# Altium project MCXE31B.PrjPcb (part 1 of 2)
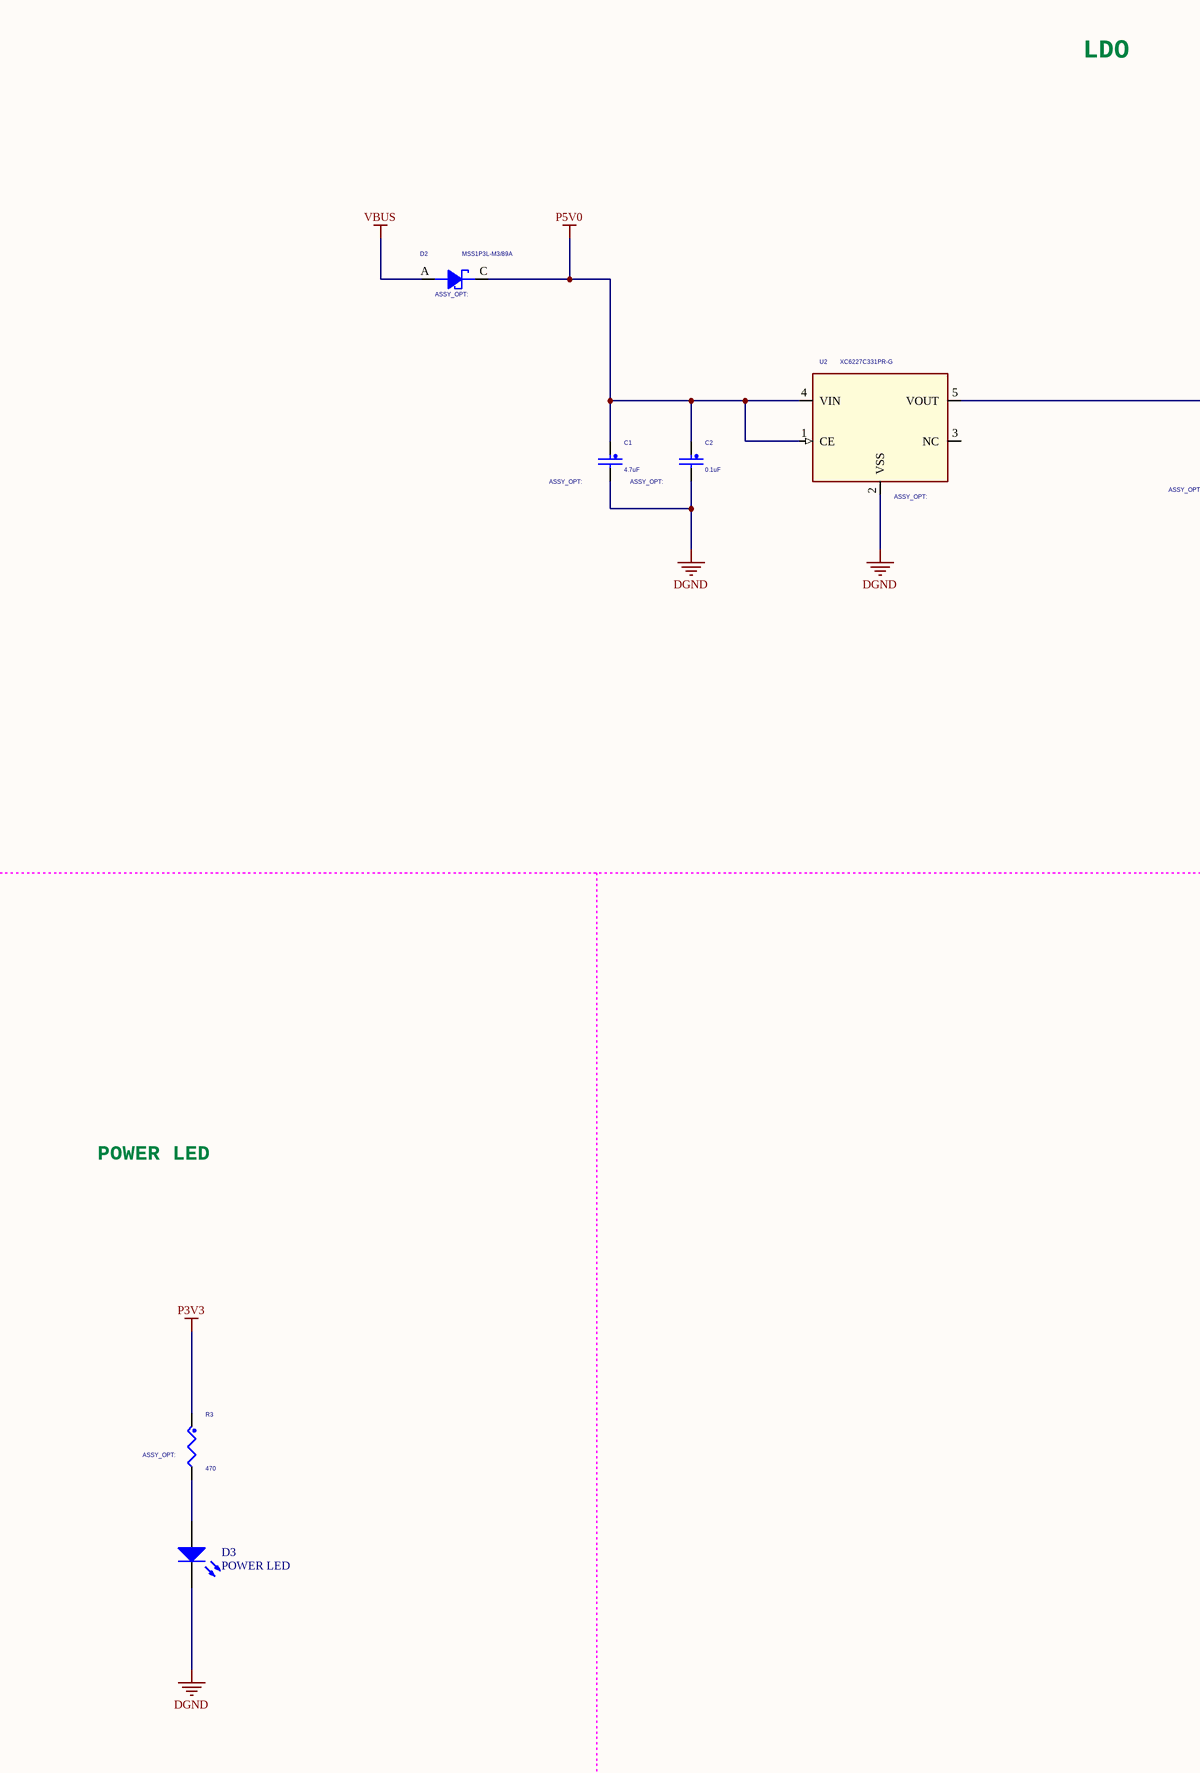
[diagram p0: 03 POWER.SchDoc, left]
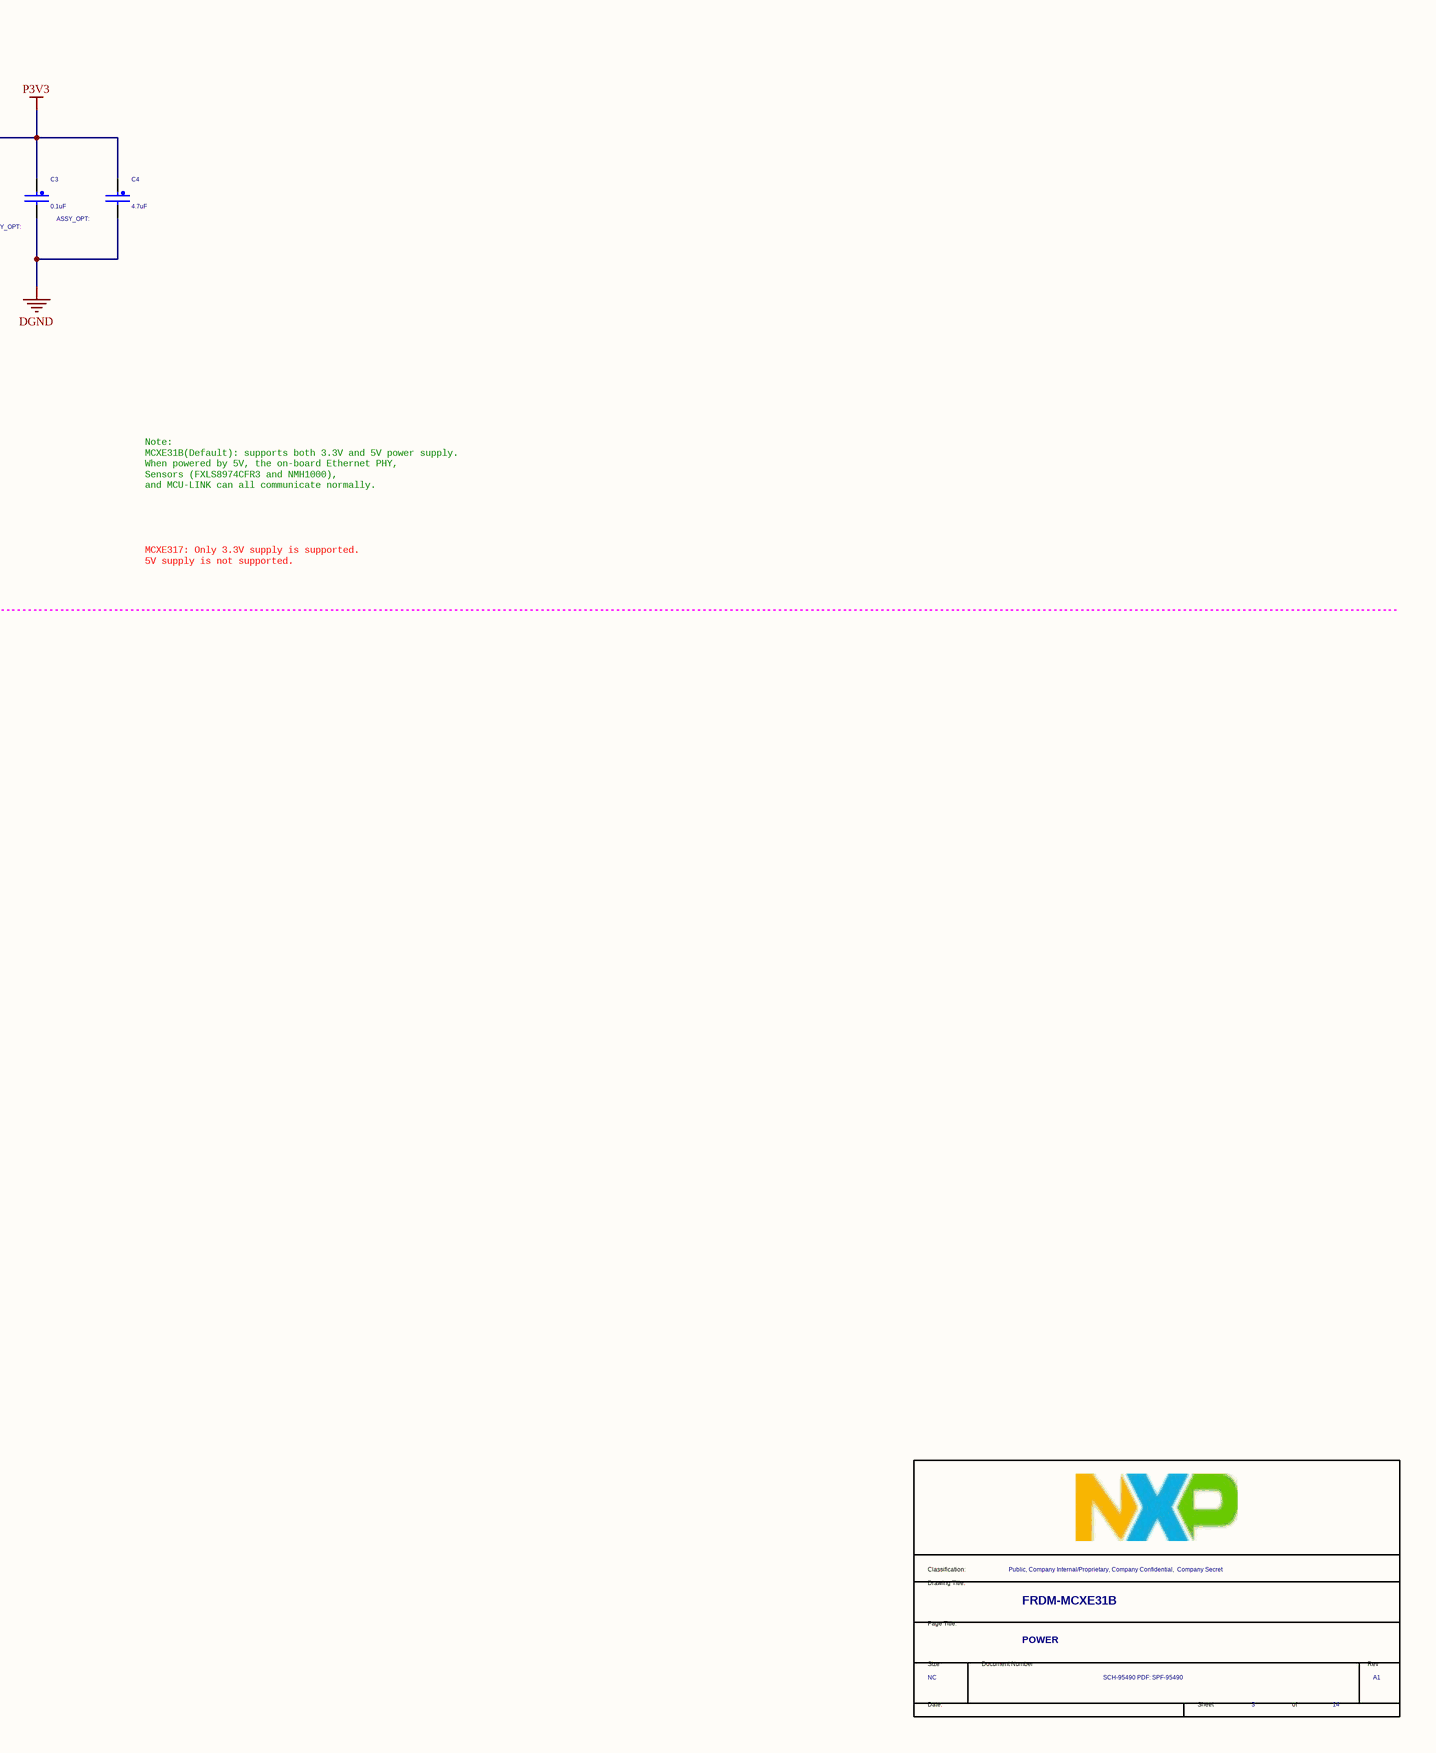
[diagram p1: 03 POWER.SchDoc, right]
13 sheets, 228 parts. Net scope: global (net labels, ports and power ports of the same name join across sheets).
Board file: MCXE31B.PcbDoc
Sheets:
  03 POWER.SchDoc
  04 MCU_AB.SchDoc
  05 MCU_C.SchDoc
  06 MCU_PORT.SchDoc
  07 MCU_LINK.SchDoc
  08 MCU_LINK_DEBUG.SchDoc
  09 ETHERNET_ENET.SchDoc
  10 CAN.SchDoc
  12 SWITCH & LED.SchDoc
  13 HEADERS.SchDoc
  CAN1.SchDoc
  UART.SchDoc
  UART2.SchDoc

## Sheet 03 POWER.SchDoc
size 513 x 386 mm

### Parts
(Parts that share a designator on the sheet are numbered #1, #2 ... from top to bottom, then left to right.)
*#1  Title: FRDM-MCXE31B  RevCode: A1  PageTitle: POWER  Page Size: NC  Page Number: 3  Page Count: 14  Doc: SCH-95490 PDF: SPF-95490  Classification: Public, Company Internal/Proprietary, Company Confidential,  Company Secret  (hidden comment: TitleBlock_FS)  (graphical)
C1  4.7uF  [CC0603_OV]
C2  0.1uF  [CC0402_25]
C3  0.1uF  [CC0402_25]
C4  4.7uF  [CC0603_OV]
D2  MFG_PN01: MSS1P3L-M3/89A  [smb_2p7x1p4]  (hidden comment: MSS1P3L)
D3  POWER LED  [LED 0603R]
R3  470  [RC0402_25]
U2  XC6227C331PR-G  [XC6227C331PR-G]

### Nets
DGND: C1.2 C2.2 C3.2 C4.2 D3.2(K) U2.2(VSS)
P3V3: C3.1 C4.1 R3.1 U2.5(VOUT)
P5V0: C1.1 C2.1 D2.C U2.1(CE) U2.4(VIN)
VBUS: D2.A
NetD3_1: D3.1(A) R3.2

Not connected (* = marked no-connect by the designer): U2 3(NC)

### Notes on the sheet
- LDO
- Note:
  MCXE31B(Default): supports both 3.3V and 5V power supply.
  When powered by 5V, the on-board Ethernet PHY,
  Sensors (FXLS8974CFR3 and NMH1000),
  and MCU-LINK can all communicate normally.
- MCXE317: Only 3.3V supply is supported.
  5V supply is not supported.
- POWER LED
- (in symbol TitleBlock_FS) Classification:; Drawing Title:; Page Title:; Size; Document Number; Rev; Date:; Sheet; of

### Library data of the parts
*#1 = TitleBlock_FS: OrgAddr2: Austin, TX 78735-8598; OrgAddr1: 6501 William Cannon Drive West; OrgName: NXP Semiconductors; Page Create Date: March  8, 1995
C1 C4 = CAP_NP: CAP CER 4.7uF 10V 20% X5R 0603; CLASS: DISCRETE; Temp Range: -55C TO 85C; TOL: 10%; FPLIST: CC0603_OV,CC0603,0603_CC; CAD_APPROVED: Yes; MFG_PN01: 885012106012; MFG_NAME01: WURTH ELEKTRONIK; AGILE_PN: 150-81893; ROOM: CPU; SIGNAL_MODEL: DEFAULT_CAPACITOR_220000pF_2_1; 3D_Mechanical_Footprint_File: http://fcl.am.freescale.net/ALLEGRO/step/cc0603_ov.STEP; Rated Voltage: 10V; Package Type: WCAP-CSGP_0603; Package Size: 0603; VOLTAGE: 10V; WVDC: 10V; HEIGHT: 0.87; ROHS: Yes; Tolerance: 20%
C2 = CAP_NP: CAP CER 0.1UF 16V 10% X7R 0402; CLASS: DISCRETE; MFG_PN01: CL05B104KO5NNNC; MFG_NAME01: Samsung Electro-Mechanics; Temp Range: -55C to +125C; CAD_APPROVED: Yes; FPLIST: CC0402_25,CC0402_HD,0402_CC,CAPC0402_L,cc0402_lamp3; AGILE_PN: 150-75182; 3D_Mechanical_Footprint_File: http://fcl.am.freescale.net/ALLEGRO/step/cc0402_25.STEP; ROHS: NULL; Rated Voltage: 16V; Tolerance: 10%; HEIGHT: 0.635mm
C3 = CAP_NP: CAP CER 0.1UF 16V 10% X7R 0402; CLASS: DISCRETE; Temp_Range: -55癈 to +85癈; FPLIST: CC0402_25,CC0402_HD,0402_CC,CAPC0402_L,cc0402_lamp3; CAD_APPROVED: Yes; MFG_PN01: CL05B104KO5NNNC; MFG_NAME01: Samsung Electro-Mechanics; AGILE_PN: 150-75182; SIGNAL_MODEL: DEFAULT_CAPACITOR_100000pF_2_1; Temp Range: -55C to +125C; VOLTAGE: 16V; TOL: 10%; HEIGHT: 0.635mm; ROHS: NULL; Tolerance: 10%; Rated Voltage: 16V; 3D_Mechanical_Footprint_File: http://fcl.am.freescale.net/ALLEGRO/step/cc0402_25.STEP
D2 = DIODE_SCHTKY: DIODE SCH 1A 30V MICROSMP SMT; CLASS: IC; MFG_NAME01: VISHAY INTERTECHNOLOGY; CAD_APPROVED: Yes; AGILE_PN: 480-76978; 3D_Mechanical_Footprint_File: http://fcl.am.freescale.net/ALLEGRO/step/smb_2p7x1p4.step; Rated Voltage: 30V; HEIGHT: 0.73
D3 = LED-SMT
R3 = RES: RES MF 470 OHM 1/16W 5% 0402; CLASS: DISCRETE; MFG_PN01: ERJ2GEJ471X; MFG_NAME01: PANASONIC; CAD_APPROVED: Yes; AGILE_PN: 470-30315; FPLIST: RC0402_25,RC0402_HD,0402_CC; ROHS: Yes; Tolerance: 5%; HEIGHT: 0.45
U2 = XC6227C_5P: IC VREG LDO  3.3V 0.7A 1.7-6.0V SOT-89-5; MFG_NAME01: TOREX; Temp Range: -40°C to 85°C; VOLTAGE: 1.7V ~ 6.0V; CAD_APPROVED: Yes; AGILE_PN: 315-80827; CLASS: IC; 3D_Mechanical_Footprint_File: http://fcl.am.freescale.net/ALLEGRO/step/sot89-5.STEP; MFG_PN01: XC6227C331PR-G; ROHS: NULL; HEIGHT: 1.6mm

## Sheet 04 MCU_AB.SchDoc
size 513 x 386 mm
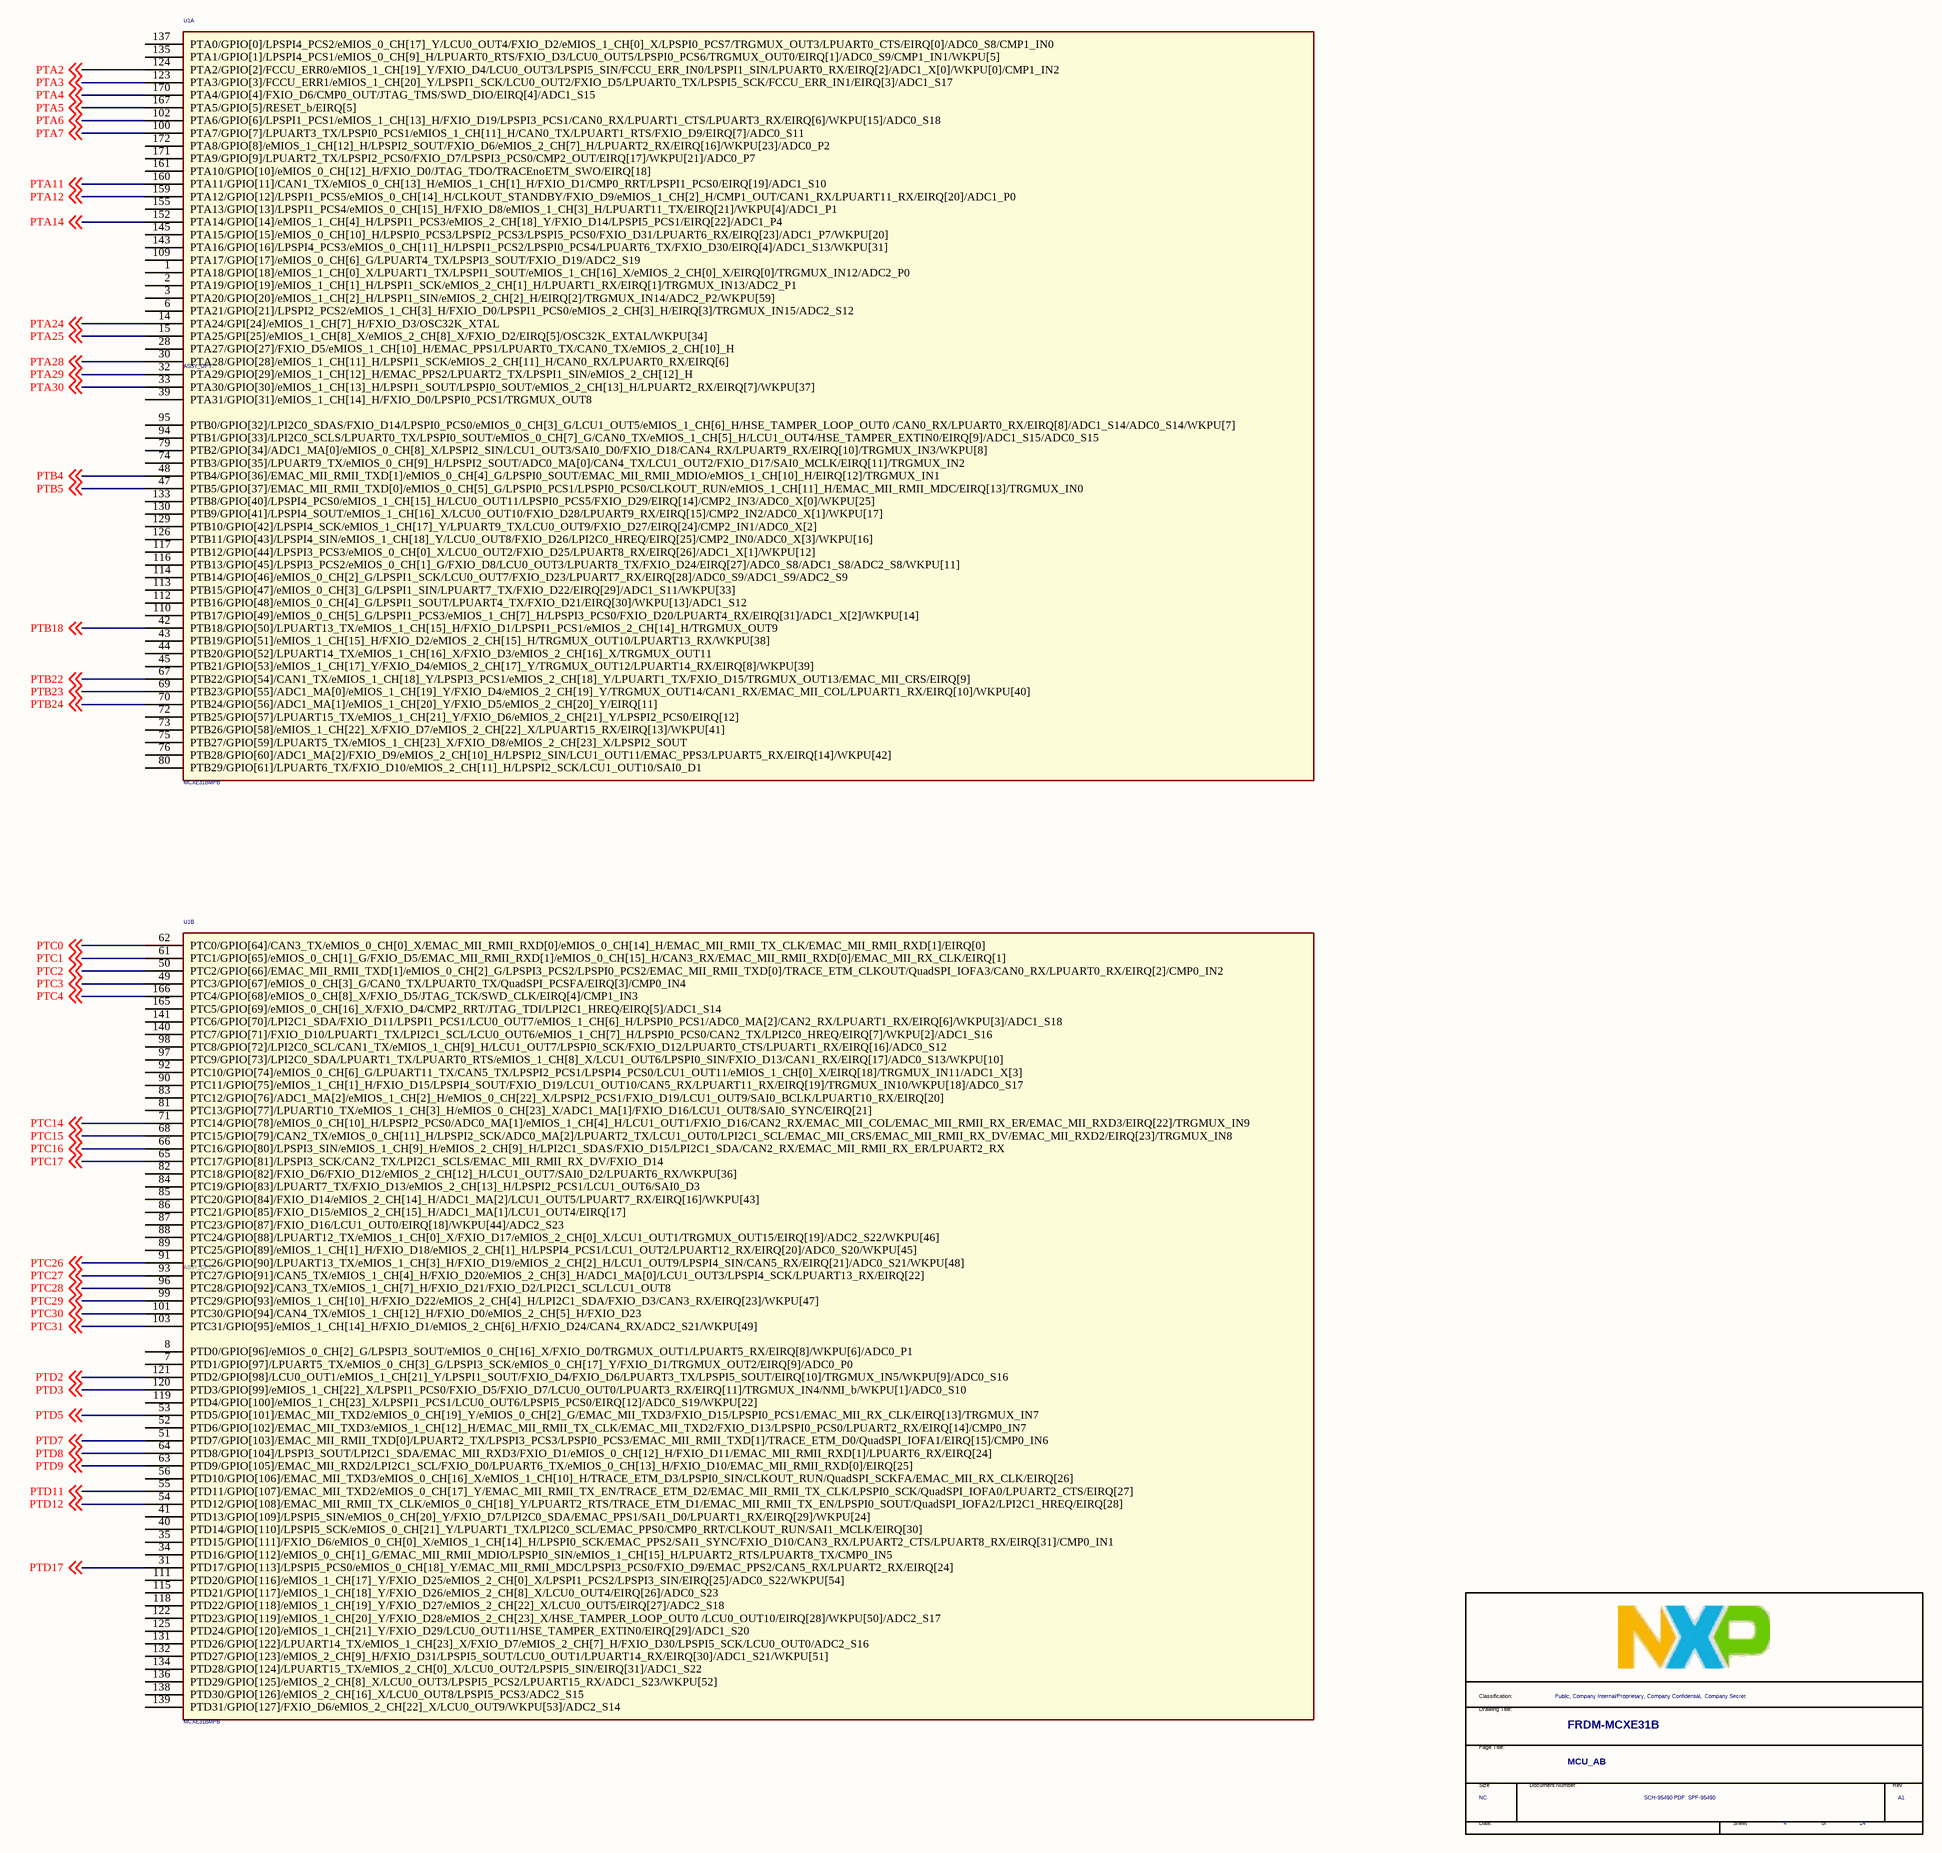
[diagram p2: 04 MCU_AB.SchDoc]

### Parts
(Parts that share a designator on the sheet are numbered #1, #2 ... from top to bottom, then left to right.)
*#2  Title: FRDM-MCXE31B  RevCode: A1  PageTitle: MCU_AB  Page Size: NC  Page Number: 4  Page Count: 14  Doc: SCH-95490 PDF: SPF-95490  Classification: Public, Company Internal/Proprietary, Company Confidential,  Company Secret  (hidden comment: TitleBlock_FS)  (graphical)
U1  MCXE31BMPB  [QFP-172_L16.0-W16.0-P0.65-LS19.0-TL]  (parts A,B of 4)

### Nets
PTA2: U1.124(PTA2/GPIO[2]/FCCU_ERR0/eMIOS_1_CH[19]_Y/FXIO_D4/LCU0_OUT3/LPSPI5_SIN/FCCU_ERR_IN0/LPSPI1_SIN/LPUART0_RX/EIRQ[2]/ADC1_X[0]/WKPU[0]/CMP1_IN2) ; off-sheet PTA2
PTA3: U1.123(PTA3/GPIO[3]/FCCU_ERR1/eMIOS_1_CH[20]_Y/LPSPI1_SCK/LCU0_OUT2/FXIO_D5/LPUART0_TX/LPSPI5_SCK/FCCU_ERR_IN1/EIRQ[3]/ADC1_S17) ; off-sheet PTA3
PTA4: U1.170(PTA4/GPIO[4]/FXIO_D6/CMP0_OUT/JTAG_TMS/SWD_DIO/EIRQ[4]/ADC1_S15) ; off-sheet PTA4
PTA5: U1.167(PTA5/GPIO[5]/RESET_b/EIRQ[5]) ; off-sheet PTA5
PTA6: U1.102(PTA6/GPIO[6]/LPSPI1_PCS1/eMIOS_1_CH[13]_H/FXIO_D19/LPSPI3_PCS1/CAN0_RX/LPUART1_CTS/LPUART3_RX/EIRQ[6]/WKPU[15]/ADC0_S18) ; off-sheet PTA6
PTA7: U1.100(PTA7/GPIO[7]/LPUART3_TX/LPSPI0_PCS1/eMIOS_1_CH[11]_H/CAN0_TX/LPUART1_RTS/FXIO_D9/EIRQ[7]/ADC0_S11) ; off-sheet PTA7
PTA11: U1.160(PTA11/GPIO[11]/CAN1_TX/eMIOS_0_CH[13]_H/eMIOS_1_CH[1]_H/FXIO_D1/CMP0_RRT/LPSPI1_PCS0/EIRQ[19]/ADC1_S10) ; off-sheet PTA11
PTA12: U1.159(PTA12/GPIO[12]/LPSPI1_PCS5/eMIOS_0_CH[14]_H/CLKOUT_STANDBY/FXIO_D9/eMIOS_1_CH[2]_H/CMP1_OUT/CAN1_RX/LPUART11_RX/EIRQ[20]/ADC1_P0) ; off-sheet PTA12
PTA14: U1.152(PTA14/GPIO[14]/eMIOS_1_CH[4]_H/LPSPI1_PCS3/eMIOS_2_CH[18]_Y/FXIO_D14/LPSPI5_PCS1/EIRQ[22]/ADC1_P4) ; off-sheet PTA14
PTA24: U1.14(PTA24/GPI[24]/eMIOS_1_CH[7]_H/FXIO_D3/OSC32K_XTAL) ; off-sheet PTA24
PTA25: U1.15(PTA25/GPI[25]/eMIOS_1_CH[8]_X/eMIOS_2_CH[8]_X/FXIO_D2/EIRQ[5]/OSC32K_EXTAL/WKPU[34]) ; off-sheet PTA25
PTA28: U1.30(PTA28/GPIO[28]/eMIOS_1_CH[11]_H/LPSPI1_SCK/eMIOS_2_CH[11]_H/CAN0_RX/LPUART0_RX/EIRQ[6]) ; off-sheet PTA28
PTA29: U1.32(PTA29/GPIO[29]/eMIOS_1_CH[12]_H/EMAC_PPS2/LPUART2_TX/LPSPI1_SIN/eMIOS_2_CH[12]_H) ; off-sheet PTA29
PTA30: U1.33(PTA30/GPIO[30]/eMIOS_1_CH[13]_H/LPSPI1_SOUT/LPSPI0_SOUT/eMIOS_2_CH[13]_H/LPUART2_RX/EIRQ[7]/WKPU[37]) ; off-sheet PTA30
PTB4: U1.48(PTB4/GPIO[36]/EMAC_MII_RMII_TXD[1]/eMIOS_0_CH[4]_G/LPSPI0_SOUT/EMAC_MII_RMII_MDIO/eMIOS_1_CH[10]_H/EIRQ[12]/TRGMUX_IN1) ; off-sheet PTB4  [project net ENET_MDIO]
PTB5: U1.47(PTB5/GPIO[37]/EMAC_MII_RMII_TXD[0]/eMIOS_0_CH[5]_G/LPSPI0_PCS1/LPSPI0_PCS0/CLKOUT_RUN/eMIOS_1_CH[11]_H/EMAC_MII_RMII_MDC/EIRQ[13]/TRGMUX_IN0) ; off-sheet PTB5  [project net ENET_MDC]
PTB18: U1.42(PTB18/GPIO[50]/LPUART13_TX/eMIOS_1_CH[15]_H/FXIO_D1/LPSPI1_PCS1/eMIOS_2_CH[14]_H/TRGMUX_OUT9) ; off-sheet PTB18
PTB22: U1.67(PTB22/GPIO[54]/CAN1_TX/eMIOS_1_CH[18]_Y/LPSPI3_PCS1/eMIOS_2_CH[18]_Y/LPUART1_TX/FXIO_D15/TRGMUX_OUT13/EMAC_MII_CRS/EIRQ[9]) ; off-sheet PTB22
PTB23: U1.69(PTB23/GPIO[55]/ADC1_MA[0]/eMIOS_1_CH[19]_Y/FXIO_D4/eMIOS_2_CH[19]_Y/TRGMUX_OUT14/CAN1_RX/EMAC_MII_COL/LPUART1_RX/EIRQ[10]/WKPU[40]) ; off-sheet PTB23
PTB24: U1.70(PTB24/GPIO[56]/ADC1_MA[1]/eMIOS_1_CH[20]_Y/FXIO_D5/eMIOS_2_CH[20]_Y/EIRQ[11]) ; off-sheet PTB24
PTC0: U1.62(PTC0/GPIO[64]/CAN3_TX/eMIOS_0_CH[0]_X/EMAC_MII_RMII_RXD[0]/eMIOS_0_CH[14]_H/EMAC_MII_RMII_TX_CLK/EMAC_MII_RMII_RXD[1]/EIRQ[0]) ; off-sheet PTC0  [project net ENET_RXD1/MODE1]
PTC1: U1.61(PTC1/GPIO[65]/eMIOS_0_CH[1]_G/FXIO_D5/EMAC_MII_RMII_RXD[1]/eMIOS_0_CH[15]_H/CAN3_RX/EMAC_MII_RMII_RXD[0]/EMAC_MII_RX_CLK/EIRQ[1]) ; off-sheet PTC1  [project net ENET_RXD0/MODE0]
PTC2: U1.50(PTC2/GPIO[66]/EMAC_MII_RMII_TXD[1]/eMIOS_0_CH[2]_G/LPSPI3_PCS2/LPSPI0_PCS2/EMAC_MII_RMII_TXD[0]/TRACE_ETM_CLKOUT/QuadSPI_IOFA3/CAN0_RX/LPUART0_RX/EIRQ[2]/CMP0_IN2) ; off-sheet PTC2  [project net ENET_TXD0]
PTC3: U1.49(PTC3/GPIO[67]/eMIOS_0_CH[3]_G/CAN0_TX/LPUART0_TX/QuadSPI_PCSFA/EIRQ[3]/CMP0_IN4) ; off-sheet PTC3  [project net ENET_PHY_RST]
PTC4: U1.166(PTC4/GPIO[68]/eMIOS_0_CH[8]_X/FXIO_D5/JTAG_TCK/SWD_CLK/EIRQ[4]/CMP1_IN3) ; off-sheet PTC4
PTC14: U1.71(PTC14/GPIO[78]/eMIOS_0_CH[10]_H/LPSPI2_PCS0/ADC0_MA[1]/eMIOS_1_CH[4]_H/LCU1_OUT1/FXIO_D16/CAN2_RX/EMAC_MII_COL/EMAC_MII_RMII_RX_ER/EMAC_MII_RXD3/EIRQ[22]/TRGMUX_IN9) ; off-sheet PTC14
PTC15: U1.68(PTC15/GPIO[79]/CAN2_TX/eMIOS_0_CH[11]_H/LPSPI2_SCK/ADC0_MA[2]/LPUART2_TX/LCU1_OUT0/LPI2C1_SCL/EMAC_MII_CRS/EMAC_MII_RMII_RX_DV/EMAC_MII_RXD2/EIRQ[23]/TRGMUX_IN8) ; off-sheet PTC15
PTC16: U1.66(PTC16/GPIO[80]/LPSPI3_SIN/eMIOS_1_CH[9]_H/eMIOS_2_CH[9]_H/LPI2C1_SDAS/FXIO_D15/LPI2C1_SDA/CAN2_RX/EMAC_MII_RMII_RX_ER/LPUART2_RX) ; off-sheet PTC16
PTC17: U1.65(PTC17/GPIO[81]/LPSPI3_SCK/CAN2_TX/LPI2C1_SCLS/EMAC_MII_RMII_RX_DV/FXIO_D14) ; off-sheet PTC17  [project net ENET_CRS_DV/MODE2]
PTC26: U1.91(PTC26/GPIO[90]/LPUART13_TX/eMIOS_1_CH[3]_H/FXIO_D19/eMIOS_2_CH[2]_H/LCU1_OUT9/LPSPI4_SIN/CAN5_RX/EIRQ[21]/ADC0_S21/WKPU[48]) ; off-sheet PTC26
PTC27: U1.93(PTC27/GPIO[91]/CAN5_TX/eMIOS_1_CH[4]_H/FXIO_D20/eMIOS_2_CH[3]_H/ADC1_MA[0]/LCU1_OUT3/LPSPI4_SCK/LPUART13_RX/EIRQ[22]) ; off-sheet PTC27
PTC28: U1.96(PTC28/GPIO[92]/CAN3_TX/eMIOS_1_CH[7]_H/FXIO_D21/FXIO_D2/LPI2C1_SCL/LCU1_OUT8) ; off-sheet PTC28
PTC29: U1.99(PTC29/GPIO[93]/eMIOS_1_CH[10]_H/FXIO_D22/eMIOS_2_CH[4]_H/LPI2C1_SDA/FXIO_D3/CAN3_RX/EIRQ[23]/WKPU[47]) ; off-sheet PTC29
PTC30: U1.101(PTC30/GPIO[94]/CAN4_TX/eMIOS_1_CH[12]_H/FXIO_D0/eMIOS_2_CH[5]_H/FXIO_D23) ; off-sheet PTC30
PTC31: U1.103(PTC31/GPIO[95]/eMIOS_1_CH[14]_H/FXIO_D1/eMIOS_2_CH[6]_H/FXIO_D24/CAN4_RX/ADC2_S21/WKPU[49]) ; off-sheet PTC31
PTD2: U1.121(PTD2/GPIO[98]/LCU0_OUT1/eMIOS_1_CH[21]_Y/LPSPI1_SOUT/FXIO_D4/FXIO_D6/LPUART3_TX/LPSPI5_SOUT/EIRQ[10]/TRGMUX_IN5/WKPU[9]/ADC0_S16) ; off-sheet PTD2  [project net LPUART3_TX]
PTD3: U1.120(PTD3/GPIO[99]/eMIOS_1_CH[22]_X/LPSPI1_PCS0/FXIO_D5/FXIO_D7/LCU0_OUT0/LPUART3_RX/EIRQ[11]/TRGMUX_IN4/NMI_b/WKPU[1]/ADC0_S10) ; off-sheet PTD3  [project net LPUART3_RX]
PTD5: U1.53(PTD5/GPIO[101]/EMAC_MII_TXD2/eMIOS_0_CH[19]_Y/eMIOS_0_CH[2]_G/EMAC_MII_TXD3/FXIO_D15/LPSPI0_PCS1/EMAC_MII_RX_CLK/EIRQ[13]/TRGMUX_IN7) ; off-sheet PTD5
PTD7: U1.51(PTD7/GPIO[103]/EMAC_MII_RMII_TXD[0]/LPUART2_TX/LPSPI3_PCS3/LPSPI0_PCS3/EMAC_MII_RMII_TXD[1]/TRACE_ETM_D0/QuadSPI_IOFA1/EIRQ[15]/CMP0_IN6) ; off-sheet PTD7  [project net ENET_TXD1]
PTD8: U1.64(PTD8/GPIO[104]/LPSPI3_SOUT/LPI2C1_SDA/EMAC_MII_RXD3/FXIO_D1/eMIOS_0_CH[12]_H/FXIO_D11/EMAC_MII_RMII_RXD[1]/LPUART6_RX/EIRQ[24]) ; off-sheet PTD8
PTD9: U1.63(PTD9/GPIO[105]/EMAC_MII_RXD2/LPI2C1_SCL/FXIO_D0/LPUART6_TX/eMIOS_0_CH[13]_H/FXIO_D10/EMAC_MII_RMII_RXD[0]/EIRQ[25]) ; off-sheet PTD9
PTD11: U1.55(PTD11/GPIO[107]/EMAC_MII_TXD2/eMIOS_0_CH[17]_Y/EMAC_MII_RMII_TX_EN/TRACE_ETM_D2/EMAC_MII_RMII_TX_CLK/LPSPI0_SCK/QuadSPI_IOFA0/LPUART2_CTS/EIRQ[27]) ; off-sheet PTD11  [project net ENET_TXCLK]
PTD12: U1.54(PTD12/GPIO[108]/EMAC_MII_RMII_TX_CLK/eMIOS_0_CH[18]_Y/LPUART2_RTS/TRACE_ETM_D1/EMAC_MII_RMII_TX_EN/LPSPI0_SOUT/QuadSPI_IOFA2/LPI2C1_HREQ/EIRQ[28]) ; off-sheet PTD12  [project net ENET_TXEN]
PTD17: U1.31(PTD17/GPIO[113]/LPSPI5_PCS0/eMIOS_0_CH[18]_Y/EMAC_MII_RMII_MDC/LPSPI3_PCS0/FXIO_D9/EMAC_PPS2/CAN5_RX/LPUART2_RX/EIRQ[24]) ; off-sheet PTD17

Not connected (* = marked no-connect by the designer): U1 1(PTA18/GPIO[18]/eMIOS_1_CH[0]_X/LPUART1_TX/LPSPI1_SOUT/eMIOS_1_CH[16]_X/eMIOS_2_CH[0]_X/EIRQ[0]/TRGMUX_IN12/ADC2_P0) 2(PTA19/GPIO[19]/eMIOS_1_CH[1]_H/LPSPI1_SCK/eMIOS_2_CH[1]_H/LPUART1_RX/EIRQ[1]/TRGMUX_IN13/ADC2_P1) 3(PTA20/GPIO[20]/eMIOS_1_CH[2]_H/LPSPI1_SIN/eMIOS_2_CH[2]_H/EIRQ[2]/TRGMUX_IN14/ADC2_P2/WKPU[59]) 6(PTA21/GPIO[21]/LPSPI2_PCS2/eMIOS_1_CH[3]_H/FXIO_D0/LPSPI1_PCS0/eMIOS_2_CH[3]_H/EIRQ[3]/TRGMUX_IN15/ADC2_S12) 7(PTD1/GPIO[97]/LPUART5_TX/eMIOS_0_CH[3]_G/LPSPI3_SCK/eMIOS_0_CH[17]_Y/FXIO_D1/TRGMUX_OUT2/EIRQ[9]/ADC0_P0) 8(PTD0/GPIO[96]/eMIOS_0_CH[2]_G/LPSPI3_SOUT/eMIOS_0_CH[16]_X/FXIO_D0/TRGMUX_OUT1/LPUART5_RX/EIRQ[8]/WKPU[6]/ADC0_P1) 28(PTA27/GPIO[27]/FXIO_D5/eMIOS_1_CH[10]_H/EMAC_PPS1/LPUART0_TX/CAN0_TX/eMIOS_2_CH[10]_H) 34(PTD16/GPIO[112]/eMIOS_0_CH[1]_G/EMAC_MII_RMII_MDIO/LPSPI0_SIN/eMIOS_1_CH[15]_H/LPUART2_RTS/LPUART8_TX/CMP0_IN5) 35(PTD15/GPIO[111]/FXIO_D6/eMIOS_0_CH[0]_X/eMIOS_1_CH[14]_H/LPSPI0_SCK/EMAC_PPS2/SAI1_SYNC/FXIO_D10/CAN3_RX/LPUART2_CTS/LPUART8_RX/EIRQ[31]/CMP0_IN1) 39(PTA31/GPIO[31]/eMIOS_1_CH[14]_H/FXIO_D0/LPSPI0_PCS1/TRGMUX_OUT8) 40(PTD14/GPIO[110]/LPSPI5_SCK/eMIOS_0_CH[21]_Y/LPUART1_TX/LPI2C0_SCL/EMAC_PPS0/CMP0_RRT/CLKOUT_RUN/SAI1_MCLK/EIRQ[30]) 41(PTD13/GPIO[109]/LPSPI5_SIN/eMIOS_0_CH[20]_Y/FXIO_D7/LPI2C0_SDA/EMAC_PPS1/SAI1_D0/LPUART1_RX/EIRQ[29]/WKPU[24]) 43(PTB19/GPIO[51]/eMIOS_1_CH[15]_H/FXIO_D2/eMIOS_2_CH[15]_H/TRGMUX_OUT10/LPUART13_RX/WKPU[38]) 44(PTB20/GPIO[52]/LPUART14_TX/eMIOS_1_CH[16]_X/FXIO_D3/eMIOS_2_CH[16]_X/TRGMUX_OUT11) 45(PTB21/GPIO[53]/eMIOS_1_CH[17]_Y/FXIO_D4/eMIOS_2_CH[17]_Y/TRGMUX_OUT12/LPUART14_RX/EIRQ[8]/WKPU[39]) 52(PTD6/GPIO[102]/EMAC_MII_TXD3/eMIOS_1_CH[12]_H/EMAC_MII_RMII_TX_CLK/EMAC_MII_TXD2/FXIO_D13/LPSPI0_PCS0/LPUART2_RX/EIRQ[14]/CMP0_IN7) 56(PTD10/GPIO[106]/EMAC_MII_TXD3/eMIOS_0_CH[16]_X/eMIOS_1_CH[10]_H/TRACE_ETM_D3/LPSPI0_SIN/CLKOUT_RUN/QuadSPI_SCKFA/EMAC_MII_RX_CLK/EIRQ[26]) 72(PTB25/GPIO[57]/LPUART15_TX/eMIOS_1_CH[21]_Y/FXIO_D6/eMIOS_2_CH[21]_Y/LPSPI2_PCS0/EIRQ[12]) 73(PTB26/GPIO[58]/eMIOS_1_CH[22]_X/FXIO_D7/eMIOS_2_CH[22]_X/LPUART15_RX/EIRQ[13]/WKPU[41]) 74(PTB3/GPIO[35]/LPUART9_TX/eMIOS_0_CH[9]_H/LPSPI2_SOUT/ADC0_MA[0]/CAN4_TX/LCU1_OUT2/FXIO_D17/SAI0_MCLK/EIRQ[11]/TRGMUX_IN2) 75(PTB27/GPIO[59]/LPUART5_TX/eMIOS_1_CH[23]_X/FXIO_D8/eMIOS_2_CH[23]_X/LPSPI2_SOUT) 76(PTB28/GPIO[60]/ADC1_MA[2]/FXIO_D9/eMIOS_2_CH[10]_H/LPSPI2_SIN/LCU1_OUT11/EMAC_PPS3/LPUART5_RX/EIRQ[14]/WKPU[42]) 79(PTB2/GPIO[34]/ADC1_MA[0]/eMIOS_0_CH[8]_X/LPSPI2_SIN/LCU1_OUT3/SAI0_D0/FXIO_D18/CAN4_RX/LPUART9_RX/EIRQ[10]/TRGMUX_IN3/WKPU[8]) 80(PTB29/GPIO[61]/LPUART6_TX/FXIO_D10/eMIOS_2_CH[11]_H/LPSPI2_SCK/LCU1_OUT10/SAI0_D1) 81(PTC13/GPIO[77]/LPUART10_TX/eMIOS_1_CH[3]_H/eMIOS_0_CH[23]_X/ADC1_MA[1]/FXIO_D16/LCU1_OUT8/SAI0_SYNC/EIRQ[21]) 82(PTC18/GPIO[82]/FXIO_D6/FXIO_D12/eMIOS_2_CH[12]_H/LCU1_OUT7/SAI0_D2/LPUART6_RX/WKPU[36]) 83(PTC12/GPIO[76]/ADC1_MA[2]/eMIOS_1_CH[2]_H/eMIOS_0_CH[22]_X/LPSPI2_PCS1/FXIO_D19/LCU1_OUT9/SAI0_BCLK/LPUART10_RX/EIRQ[20]) 84(PTC19/GPIO[83]/LPUART7_TX/FXIO_D13/eMIOS_2_CH[13]_H/LPSPI2_PCS1/LCU1_OUT6/SAI0_D3) 85(PTC20/GPIO[84]/FXIO_D14/eMIOS_2_CH[14]_H/ADC1_MA[2]/LCU1_OUT5/LPUART7_RX/EIRQ[16]/WKPU[43]) 86(PTC21/GPIO[85]/FXIO_D15/eMIOS_2_CH[15]_H/ADC1_MA[1]/LCU1_OUT4/EIRQ[17]) 87(PTC23/GPIO[87]/FXIO_D16/LCU1_OUT0/EIRQ[18]/WKPU[44]/ADC2_S23) 88(PTC24/GPIO[88]/LPUART12_TX/eMIOS_1_CH[0]_X/FXIO_D17/eMIOS_2_CH[0]_X/LCU1_OUT1/TRGMUX_OUT15/EIRQ[19]/ADC2_S22/WKPU[46]) 89(PTC25/GPIO[89]/eMIOS_1_CH[1]_H/FXIO_D18/eMIOS_2_CH[1]_H/LPSPI4_PCS1/LCU1_OUT2/LPUART12_RX/EIRQ[20]/ADC0_S20/WKPU[45]) 90(PTC11/GPIO[75]/eMIOS_1_CH[1]_H/FXIO_D15/LPSPI4_SOUT/FXIO_D19/LCU1_OUT10/CAN5_RX/LPUART11_RX/EIRQ[19]/TRGMUX_IN10/WKPU[18]/ADC0_S17) 92(PTC10/GPIO[74]/eMIOS_0_CH[6]_G/LPUART11_TX/CAN5_TX/LPSPI2_PCS1/LPSPI4_PCS0/LCU1_OUT11/eMIOS_1_CH[0]_X/EIRQ[18]/TRGMUX_IN11/ADC1_X[3]) 94(PTB1/GPIO[33]/LPI2C0_SCLS/LPUART0_TX/LPSPI0_SOUT/eMIOS_0_CH[7]_G/CAN0_TX/eMIOS_1_CH[5]_H/LCU1_OUT4/HSE_TAMPER_EXTIN0/EIRQ[9]/ADC1_S15/ADC0_S15) 95(PTB0/GPIO[32]/LPI2C0_SDAS/FXIO_D14/LPSPI0_PCS0/eMIOS_0_CH[3]_G/LCU1_OUT5/eMIOS_1_CH[6]_H/HSE_TAMPER_LOOP_OUT0_/CAN0_RX/LPUART0_RX/EIRQ[8]/ADC1_S14/ADC0_S14/WKPU[7]) 97(PTC9/GPIO[73]/LPI2C0_SDA/LPUART1_TX/LPUART0_RTS/eMIOS_1_CH[8]_X/LCU1_OUT6/LPSPI0_SIN/FXIO_D13/CAN1_RX/EIRQ[17]/ADC0_S13/WKPU[10]) 98(PTC8/GPIO[72]/LPI2C0_SCL/CAN1_TX/eMIOS_1_CH[9]_H/LCU1_OUT7/LPSPI0_SCK/FXIO_D12/LPUART0_CTS/LPUART1_RX/EIRQ[16]/ADC0_S12) 109(PTA17/GPIO[17]/eMIOS_0_CH[6]_G/LPUART4_TX/LPSPI3_SOUT/FXIO_D19/ADC2_S19) 110(PTB17/GPIO[49]/eMIOS_0_CH[5]_G/LPSPI1_PCS3/eMIOS_1_CH[7]_H/LPSPI3_PCS0/FXIO_D20/LPUART4_RX/EIRQ[31]/ADC1_X[2]/WKPU[14]) 111(PTD20/GPIO[116]/eMIOS_1_CH[17]_Y/FXIO_D25/eMIOS_2_CH[0]_X/LPSPI1_PCS2/LPSPI3_SIN/EIRQ[25]/ADC0_S22/WKPU[54]) 112(PTB16/GPIO[48]/eMIOS_0_CH[4]_G/LPSPI1_SOUT/LPUART4_TX/FXIO_D21/EIRQ[30]/WKPU[13]/ADC1_S12) 113(PTB15/GPIO[47]/eMIOS_0_CH[3]_G/LPSPI1_SIN/LPUART7_TX/FXIO_D22/EIRQ[29]/ADC1_S11/WKPU[33]) 114(PTB14/GPIO[46]/eMIOS_0_CH[2]_G/LPSPI1_SCK/LCU0_OUT7/FXIO_D23/LPUART7_RX/EIRQ[28]/ADC0_S9/ADC1_S9/ADC2_S9) 115(PTD21/GPIO[117]/eMIOS_1_CH[18]_Y/FXIO_D26/eMIOS_2_CH[8]_X/LCU0_OUT4/EIRQ[26]/ADC0_S23) 116(PTB13/GPIO[45]/LPSPI3_PCS2/eMIOS_0_CH[1]_G/FXIO_D8/LCU0_OUT3/LPUART8_TX/FXIO_D24/EIRQ[27]/ADC0_S8/ADC1_S8/ADC2_S8/WKPU[11]) 117(PTB12/GPIO[44]/LPSPI3_PCS3/eMIOS_0_CH[0]_X/LCU0_OUT2/FXIO_D25/LPUART8_RX/EIRQ[26]/ADC1_X[1]/WKPU[12]) 118(PTD22/GPIO[118]/eMIOS_1_CH[19]_Y/FXIO_D27/eMIOS_2_CH[22]_X/LCU0_OUT5/EIRQ[27]/ADC2_S18) 119(PTD4/GPIO[100]/eMIOS_1_CH[23]_X/LPSPI1_PCS1/LCU0_OUT6/LPSPI5_PCS0/EIRQ[12]/ADC0_S19/WKPU[22]) 122(PTD23/GPIO[119]/eMIOS_1_CH[20]_Y/FXIO_D28/eMIOS_2_CH[23]_X/HSE_TAMPER_LOOP_OUT0_/LCU0_OUT10/EIRQ[28]/WKPU[50]/ADC2_S17) 125(PTD24/GPIO[120]/eMIOS_1_CH[21]_Y/FXIO_D29/LCU0_OUT11/HSE_TAMPER_EXTIN0/EIRQ[29]/ADC1_S20) 126(PTB11/GPIO[43]/LPSPI4_SIN/eMIOS_1_CH[18]_Y/LCU0_OUT8/FXIO_D26/LPI2C0_HREQ/EIRQ[25]/CMP2_IN0/ADC0_X[3]/WKPU[16]) 129(PTB10/GPIO[42]/LPSPI4_SCK/eMIOS_1_CH[17]_Y/LPUART9_TX/LCU0_OUT9/FXIO_D27/EIRQ[24]/CMP2_IN1/ADC0_X[2]) 130(PTB9/GPIO[41]/LPSPI4_SOUT/eMIOS_1_CH[16]_X/LCU0_OUT10/FXIO_D28/LPUART9_RX/EIRQ[15]/CMP2_IN2/ADC0_X[1]/WKPU[17]) 131(PTD26/GPIO[122]/LPUART14_TX/eMIOS_1_CH[23]_X/FXIO_D7/eMIOS_2_CH[7]_H/FXIO_D30/LPSPI5_SCK/LCU0_OUT0/ADC2_S16) 132(PTD27/GPIO[123]/eMIOS_2_CH[9]_H/FXIO_D31/LPSPI5_SOUT/LCU0_OUT1/LPUART14_RX/EIRQ[30]/ADC1_S21/WKPU[51]) 133(PTB8/GPIO[40]/LPSPI4_PCS0/eMIOS_1_CH[15]_H/LCU0_OUT11/LPSPI0_PCS5/FXIO_D29/EIRQ[14]/CMP2_IN3/ADC0_X[0]/WKPU[25]) 134(PTD28/GPIO[124]/LPUART15_TX/eMIOS_2_CH[0]_X/LCU0_OUT2/LPSPI5_SIN/EIRQ[31]/ADC1_S22) 135(PTA1/GPIO[1]/LPSPI4_PCS1/eMIOS_0_CH[9]_H/LPUART0_RTS/FXIO_D3/LCU0_OUT5/LPSPI0_PCS6/TRGMUX_OUT0/EIRQ[1]/ADC0_S9/CMP1_IN1/WKPU[5]) 136(PTD29/GPIO[125]/eMIOS_2_CH[8]_X/LCU0_OUT3/LPSPI5_PCS2/LPUART15_RX/ADC1_S23/WKPU[52]) 137(PTA0/GPIO[0]/LPSPI4_PCS2/eMIOS_0_CH[17]_Y/LCU0_OUT4/FXIO_D2/eMIOS_1_CH[0]_X/LPSPI0_PCS7/TRGMUX_OUT3/LPUART0_CTS/EIRQ[0]/ADC0_S8/CMP1_IN0) 138(PTD30/GPIO[126]/eMIOS_2_CH[16]_X/LCU0_OUT8/LPSPI5_PCS3/ADC2_S15) 139(PTD31/GPIO[127]/FXIO_D6/eMIOS_2_CH[22]_X/LCU0_OUT9/WKPU[53]/ADC2_S14) 140(PTC7/GPIO[71]/FXIO_D10/LPUART1_TX/LPI2C1_SCL/LCU0_OUT6/eMIOS_1_CH[7]_H/LPSPI0_PCS0/CAN2_TX/LPI2C0_HREQ/EIRQ[7]/WKPU[2]/ADC1_S16) 141(PTC6/GPIO[70]/LPI2C1_SDA/FXIO_D11/LPSPI1_PCS1/LCU0_OUT7/eMIOS_1_CH[6]_H/LPSPI0_PCS1/ADC0_MA[2]/CAN2_RX/LPUART1_RX/EIRQ[6]/WKPU[3]/ADC1_S18) 143(PTA16/GPIO[16]/LPSPI4_PCS3/eMIOS_0_CH[11]_H/LPSPI1_PCS2/LPSPI0_PCS4/LPUART6_TX/FXIO_D30/EIRQ[4]/ADC1_S13/WKPU[31]) 145(PTA15/GPIO[15]/eMIOS_0_CH[10]_H/LPSPI0_PCS3/LPSPI2_PCS3/LPSPI5_PCS0/FXIO_D31/LPUART6_RX/EIRQ[23]/ADC1_P7/WKPU[20]) 155(PTA13/GPIO[13]/LPSPI1_PCS4/eMIOS_0_CH[15]_H/FXIO_D8/eMIOS_1_CH[3]_H/LPUART11_TX/EIRQ[21]/WKPU[4]/ADC1_P1) 161(PTA10/GPIO[10]/eMIOS_0_CH[12]_H/FXIO_D0/JTAG_TDO/TRACEnoETM_SWO/EIRQ[18]) 165(PTC5/GPIO[69]/eMIOS_0_CH[16]_X/FXIO_D4/CMP2_RRT/JTAG_TDI/LPI2C1_HREQ/EIRQ[5]/ADC1_S14) 171(PTA9/GPIO[9]/LPUART2_TX/LPSPI2_PCS0/FXIO_D7/LPSPI3_PCS0/CMP2_OUT/EIRQ[17]/WKPU[21]/ADC0_P7) 172(PTA8/GPIO[8]/eMIOS_1_CH[12]_H/LPSPI2_SOUT/FXIO_D6/eMIOS_2_CH[7]_H/LPUART2_RX/EIRQ[16]/WKPU[23]/ADC0_P2)

### Notes on the sheet
- (in symbol TitleBlock_FS) Classification:; Drawing Title:; Page Title:; Size; Document Number; Rev; Date:; Sheet; of

### Library data of the parts
*#2 = TitleBlock_FS: OrgName: NXP Semiconductors; OrgAddr1: 6501 William Cannon Drive West; OrgAddr2: Austin, TX 78735-8598; Page Create Date: March  8, 1995
U1 = MCXE318MPB_172P: IC MCU 4M FLASH 2.97-5.5V 160MHZ HDQFP172; AGILE_PN: TMP-CIP-19819; CAD_APPROVED: Yes; PRE_APN: 344-10070; Temp Range: -40°C to +125°C; MFG_NAME01: NXP SEMICONDUCTOR; CLASS: IC; HEIGHT: 1.75mm; ROHS: NULL; MFG_PN01: MCXE31BMPB; 3D_Mechanical_Footprint_File: http://fcl.am.freescale.net/ALLEGRO/step/hdqfp172_0P65_16X16_sm.STEP

## Sheet 05 MCU_C.SchDoc
size 513 x 386 mm
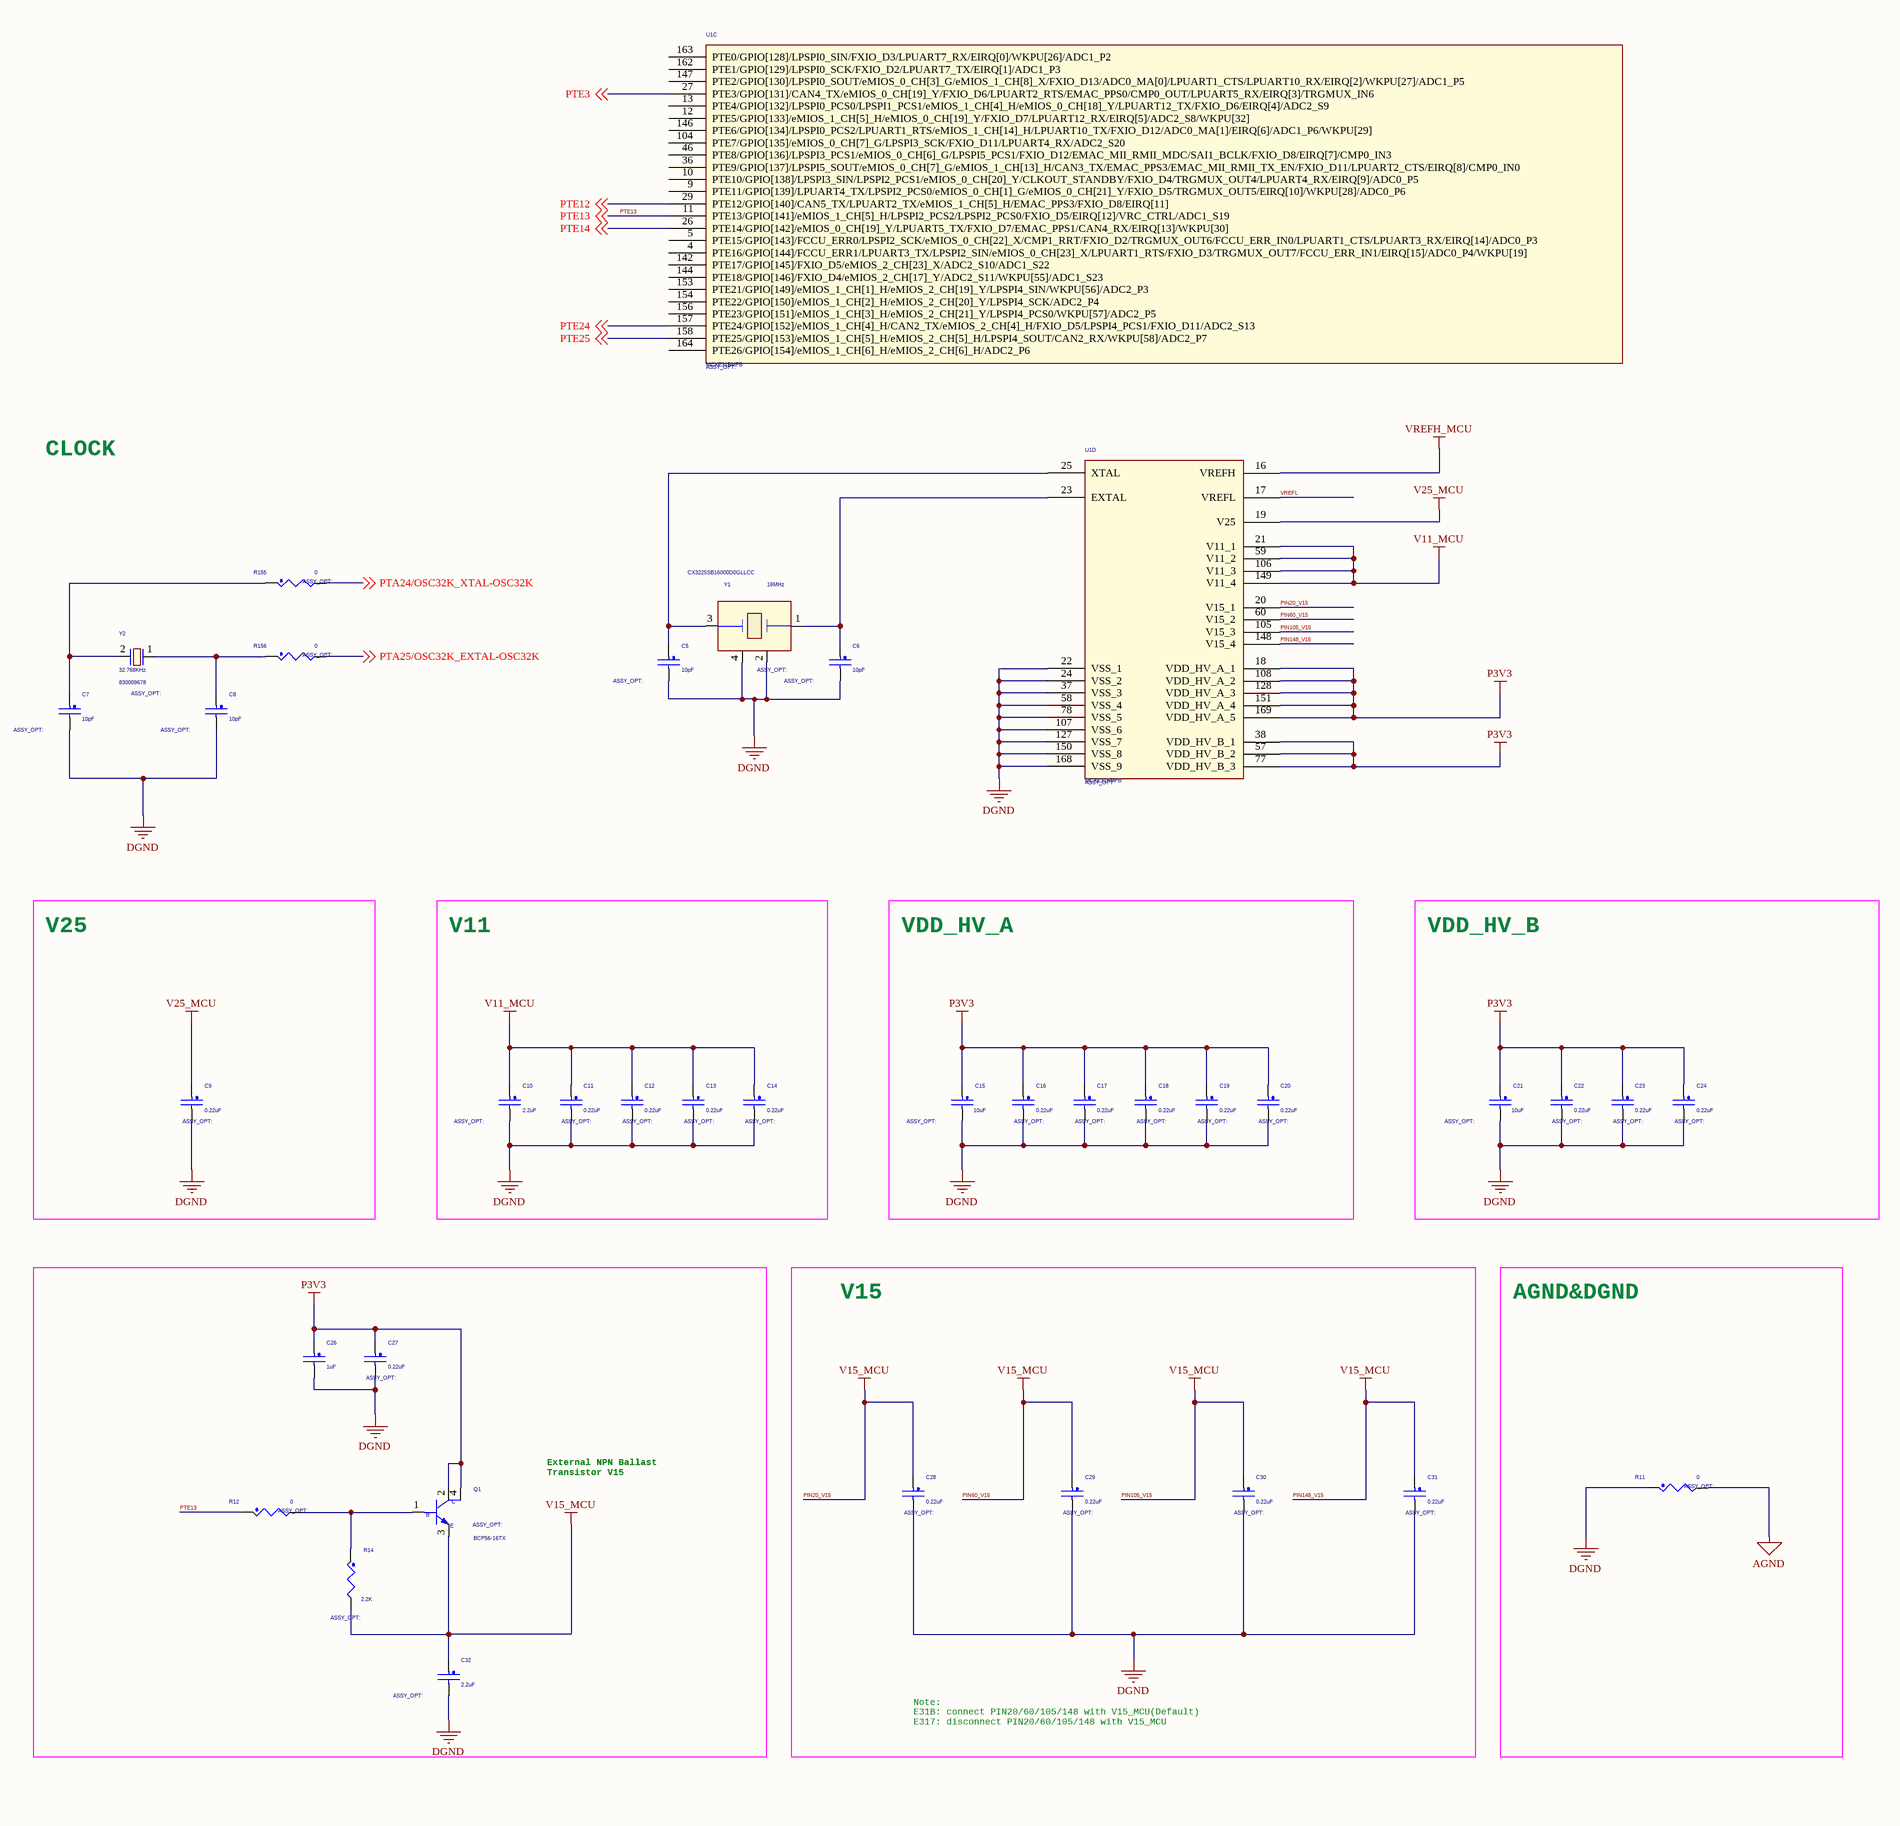
[diagram p3: 05 MCU_C.SchDoc, left]
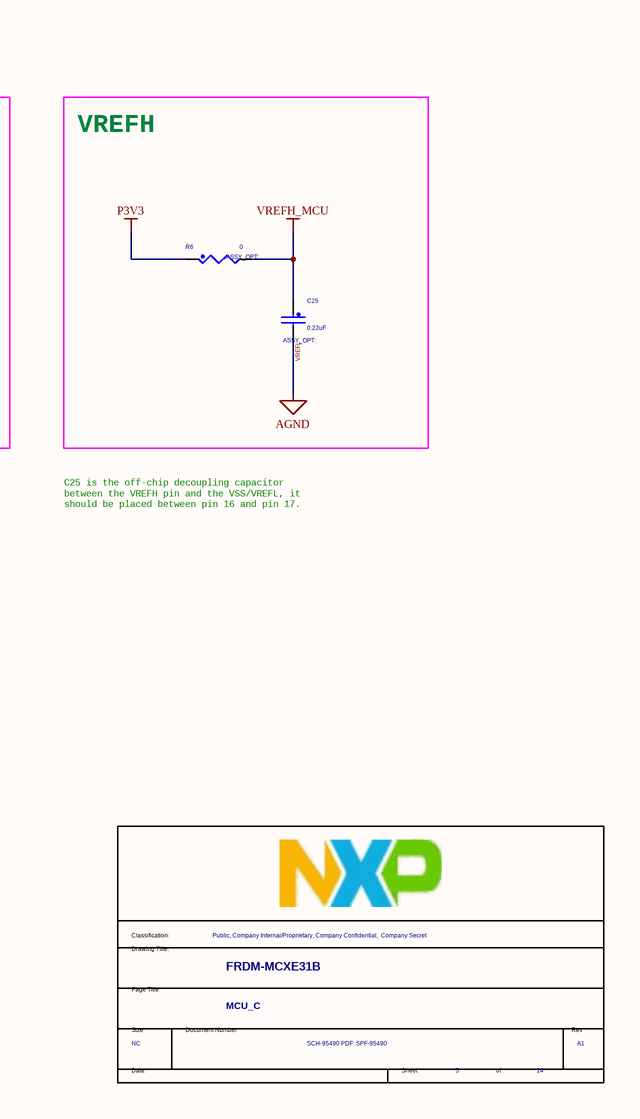
[diagram p4: 05 MCU_C.SchDoc, right]

### Parts
(Parts that share a designator on the sheet are numbered #1, #2 ... from top to bottom, then left to right.)
*#3  Title: FRDM-MCXE31B  RevCode: A1  PageTitle: MCU_C  Page Size: NC  Page Number: 5  Page Count: 14  Doc: SCH-95490 PDF: SPF-95490  Classification: Public, Company Internal/Proprietary, Company Confidential,  Company Secret  (hidden comment: TitleBlock_FS)  (graphical)
C5  10pF  [CC0402_25]
C6  10pF  [CC0402_25]
C7  10pF  [CC0402_25]
C8  10pF  [CC0402_25]
C9  0.22uF  [CC0402_25]
C10  2.2uF  [CC0402_25]
C11  0.22uF  [CC0402_25]
C12  0.22uF  [CC0402_25]
C13  0.22uF  [CC0402_25]
C14  0.22uF  [CC0402_25]
C15  10uF  [CC0603_OV]
C16  0.22uF  [CC0402_25]
C17  0.22uF  [CC0402_25]
C18  0.22uF  [CC0402_25]
C19  0.22uF  [CC0402_25]
C20  0.22uF  [CC0402_25]
C21  10uF  [CC0603_OV]
C22  0.22uF  [CC0402_25]
C23  0.22uF  [CC0402_25]
C24  0.22uF  [CC0402_25]
C25  0.22uF  [CC0402_25]
C26  1uF  [CC0402_25]
C27  0.22uF  [CC0402_25]
C28  0.22uF  [CC0402_25]
C29  0.22uF  [CC0402_25]
C30  0.22uF  [CC0402_25]
C31  0.22uF  [CC0402_25]
C32  2.2uF  [CC0402_25]
Q1  BCP56-16TX  [SOT223]
R6  0  [RC0402_25]
R11  0  [RC0603_OV]
R12  0  [RC0603_OV]
R14  2.2K  [RC0402_25]
R155  0  [RC0402_25]
R156  0  [RC0402_25]
U1  MCXE31BMPB  [QFP-172_L16.0-W16.0-P0.65-LS19.0-TL]  (parts C,D of 4)
Y1  16MHz  MFG_PN01: CX3225SB16000D0GLLCC  [X322516MLB4SI]
Y2  32.768KHz  MFG_PN01: 830009678  [XTAL2-3p2x1p5-SM]

### Blocks framed on the sheet
V25: C9
V11: C10-C14
VDD_HV_A: C15-C20
VDD_HV_B: C21-C24
VREFH: C25 R6
V15: C28-C31
AGND&DGND: R11

### Nets
DGND: C5.2 C6.2 C7.2 C8.2 C9.2 C10.2 C11.2 C12.2 C13.2 C14.2 C15.2 C16.2 C17.2 C18.2 C19.2 C20.2 C21.2 C22.2 C23.2 C24.2 C26.2 C27.2 C28.2 C29.2 C30.2 C31.2 C32.2 R11.1 U1.22(VSS_1) U1.24(VSS_2) U1.37(VSS_3) U1.58(VSS_4) U1.78(VSS_5) U1.107(VSS_6) U1.127(VSS_7) U1.150(VSS_8) U1.168(VSS_9) Y1.2 Y1.4
P3V3: C15.1 C16.1 C17.1 C18.1 C19.1 C20.1 C21.1 C22.1 C23.1 C24.1 C26.1 C27.1 Q1.2(COLLECTOR) Q1.4(COLLECTOR1) R6.1 U1.18(VDD_HV_A_1) U1.38(VDD_HV_B_1) U1.57(VDD_HV_B_2) U1.77(VDD_HV_B_3) U1.108(VDD_HV_A_2) U1.128(VDD_HV_A_3) U1.151(VDD_HV_A_4) U1.169(VDD_HV_A_5)
PIN105_V15: C28.1 C29.1 C30.1 C31.1 C32.1 Q1.3(EMITTER) R14.2 U1.20(V15_1) U1.60(V15_2) U1.105(V15_3) U1.148(V15_4)  [also labelled PIN148_V15, PIN20_V15, PIN60_V15, V15_MCU]
V11_MCU: C10.1 C11.1 C12.1 C13.1 C14.1 U1.21(V11_1) U1.59(V11_2) U1.106(V11_3) U1.149(V11_4)
V25_MCU: C9.1 U1.19(V25)
VREFH_MCU: C25.1 R6.2 U1.16(VREFH)
VREFL: C25.2 R11.2 U1.17(VREFL)  [also labelled AGND]
PTA24/OSC32K_XTAL-OSC32K: R155.2 ; off-sheet PTA24/OSC32K_XTAL-OSC32K  [project net PTA24]
PTA25/OSC32K_EXTAL-OSC32K: R156.2 ; off-sheet PTA25/OSC32K_EXTAL-OSC32K  [project net PTA25]
PTE3: U1.27(PTE3/GPIO[131]/CAN4_TX/eMIOS_0_CH[19]_Y/FXIO_D6/LPUART2_RTS/EMAC_PPS0/CMP0_OUT/LPUART5_RX/EIRQ[3]/TRGMUX_IN6) ; off-sheet PTE3
PTE12: U1.29(PTE12/GPIO[140]/CAN5_TX/LPUART2_TX/eMIOS_1_CH[5]_H/EMAC_PPS3/FXIO_D8/EIRQ[11]) ; off-sheet PTE12
PTE13: R12.1 U1.11(PTE13/GPIO[141]/eMIOS_1_CH[5]_H/LPSPI2_PCS2/LPSPI2_PCS0/FXIO_D5/EIRQ[12]/VRC_CTRL/ADC1_S19) ; off-sheet PTE13
PTE14: U1.26(PTE14/GPIO[142]/eMIOS_0_CH[19]_Y/LPUART5_TX/FXIO_D7/EMAC_PPS1/CAN4_RX/EIRQ[13]/WKPU[30]) ; off-sheet PTE14
PTE24: U1.157(PTE24/GPIO[152]/eMIOS_1_CH[4]_H/CAN2_TX/eMIOS_2_CH[4]_H/FXIO_D5/LPSPI4_PCS1/FXIO_D11/ADC2_S13) ; off-sheet PTE24
PTE25: U1.158(PTE25/GPIO[153]/eMIOS_1_CH[5]_H/eMIOS_2_CH[5]_H/LPSPI4_SOUT/CAN2_RX/WKPU[58]/ADC2_P7) ; off-sheet PTE25
NetC5_1: C5.1 U1.25(XTAL) Y1.3
NetC6_1: C6.1 U1.23(EXTAL) Y1.1
NetC7_1: C7.1 R155.1 Y2.2
NetC8_1: C8.1 R156.1 Y2.1
NetQ1_1: Q1.1(BASE) R12.2 R14.1

Not connected (* = marked no-connect by the designer): U1 4(PTE16/GPIO[144]/FCCU_ERR1/LPUART3_TX/LPSPI2_SIN/eMIOS_0_CH[23]_X/LPUART1_RTS/FXIO_D3/TRGMUX_OUT7/FCCU_ERR_IN1/EIRQ[15]/ADC0_P4/WKPU[19]) 5(PTE15/GPIO[143]/FCCU_ERR0/LPSPI2_SCK/eMIOS_0_CH[22]_X/CMP1_RRT/FXIO_D2/TRGMUX_OUT6/FCCU_ERR_IN0/LPUART1_CTS/LPUART3_RX/EIRQ[14]/ADC0_P3) 9(PTE11/GPIO[139]/LPUART4_TX/LPSPI2_PCS0/eMIOS_0_CH[1]_G/eMIOS_0_CH[21]_Y/FXIO_D5/TRGMUX_OUT5/EIRQ[10]/WKPU[28]/ADC0_P6) 10(PTE10/GPIO[138]/LPSPI3_SIN/LPSPI2_PCS1/eMIOS_0_CH[20]_Y/CLKOUT_STANDBY/FXIO_D4/TRGMUX_OUT4/LPUART4_RX/EIRQ[9]/ADC0_P5) 12(PTE5/GPIO[133]/eMIOS_1_CH[5]_H/eMIOS_0_CH[19]_Y/FXIO_D7/LPUART12_RX/EIRQ[5]/ADC2_S8/WKPU[32]) 13(PTE4/GPIO[132]/LPSPI0_PCS0/LPSPI1_PCS1/eMIOS_1_CH[4]_H/eMIOS_0_CH[18]_Y/LPUART12_TX/FXIO_D6/EIRQ[4]/ADC2_S9) 36(PTE9/GPIO[137]/LPSPI5_SOUT/eMIOS_0_CH[7]_G/eMIOS_1_CH[13]_H/CAN3_TX/EMAC_PPS3/EMAC_MII_RMII_TX_EN/FXIO_D11/LPUART2_CTS/EIRQ[8]/CMP0_IN0) 46(PTE8/GPIO[136]/LPSPI3_PCS1/eMIOS_0_CH[6]_G/LPSPI5_PCS1/FXIO_D12/EMAC_MII_RMII_MDC/SAI1_BCLK/FXIO_D8/EIRQ[7]/CMP0_IN3) 104(PTE7/GPIO[135]/eMIOS_0_CH[7]_G/LPSPI3_SCK/FXIO_D11/LPUART4_RX/ADC2_S20) 142(PTE17/GPIO[145]/FXIO_D5/eMIOS_2_CH[23]_X/ADC2_S10/ADC1_S22) 144(PTE18/GPIO[146]/FXIO_D4/eMIOS_2_CH[17]_Y/ADC2_S11/WKPU[55]/ADC1_S23) 146(PTE6/GPIO[134]/LPSPI0_PCS2/LPUART1_RTS/eMIOS_1_CH[14]_H/LPUART10_TX/FXIO_D12/ADC0_MA[1]/EIRQ[6]/ADC1_P6/WKPU[29]) 147(PTE2/GPIO[130]/LPSPI0_SOUT/eMIOS_0_CH[3]_G/eMIOS_1_CH[8]_X/FXIO_D13/ADC0_MA[0]/LPUART1_CTS/LPUART10_RX/EIRQ[2]/WKPU[27]/ADC1_P5) 153(PTE21/GPIO[149]/eMIOS_1_CH[1]_H/eMIOS_2_CH[19]_Y/LPSPI4_SIN/WKPU[56]/ADC2_P3) 154(PTE22/GPIO[150]/eMIOS_1_CH[2]_H/eMIOS_2_CH[20]_Y/LPSPI4_SCK/ADC2_P4) 156(PTE23/GPIO[151]/eMIOS_1_CH[3]_H/eMIOS_2_CH[21]_Y/LPSPI4_PCS0/WKPU[57]/ADC2_P5) 162(PTE1/GPIO[129]/LPSPI0_SCK/FXIO_D2/LPUART7_TX/EIRQ[1]/ADC1_P3) 163(PTE0/GPIO[128]/LPSPI0_SIN/FXIO_D3/LPUART7_RX/EIRQ[0]/WKPU[26]/ADC1_P2) 164(PTE26/GPIO[154]/eMIOS_1_CH[6]_H/eMIOS_2_CH[6]_H/ADC2_P6)

### Notes on the sheet
- CLOCK
- C25 is the off-chip decoupling capacitor
  between the VREFH pin and the VSS/VREFL, it
  should be placed between pin 16 and pin 17.
- External NPN Ballast
  Transistor V15
- Note:
  E31B: connect PIN20/60/105/148 with V15_MCU(Default)
  E317: disconnect PIN20/60/105/148 with V15_MCU
- (in symbol TitleBlock_FS) Classification:; Drawing Title:; Page Title:; Size; Document Number; Rev; Date:; Sheet; of
- (in symbol TRAN_NPN_SOT223) C; B; E

### Library data of the parts
*#3 = TitleBlock_FS: as *#1 on sheet 03 POWER; Page Create Date: March  8, 1995
C5 = CAP_NP: CAP CER 10pF 50V 5% C0G AEC-Q200 0402; CLASS: DISCRETE; AGILE_PN: 150-79023; FPLIST: CC0402_25,CC0402_HD,0402_CC,capc0402_l; CAD_APPROVED: Yes; Temp Range: -55C to +125C; MFG_NAME01: MURATA; MFG_PN01: GCM1555C1H100JA16; Package Size: 0402 [1005 Metric]; HEIGHT: 0.55; Package Type: SMD/SMT; Tolerance: 5%; Rated Voltage: 50V; ROHS: Yes; VOLTAGE: 50V; 3D_Mechanical_Footprint_File: http://fcl.am.freescale.net/ALLEGRO/step/cc0402_25.STEP
C6-C8 = CAP_NP: CAP CER 10pF 50V 5% C0G AEC-Q200 0402; CLASS: DISCRETE; MFG_PN01: GCM1555C1H100JA16; MFG_NAME01: MURATA; Temp Range: -55C to +125C; CAD_APPROVED: Yes; FPLIST: CC0402_25,CC0402_HD,0402_CC,capc0402_l; AGILE_PN: 150-79023; 3D_Mechanical_Footprint_File: http://fcl.am.freescale.net/ALLEGRO/step/cc0402_25.STEP; VOLTAGE: 50V; ROHS: Yes; Rated Voltage: 50V; Tolerance: 5%; Package Type: SMD/SMT; HEIGHT: 0.55; Package Size: 0402 [1005 Metric]
C9 C11-C14 C16-C20 C25 C27 = CAP_NP: CAP CER 0.22UF 16V 10% X7R 0402; CLASS: DISCRETE; AGILE_PN: 150-78886; MFG_NAME01: FENGHUA; MFG_PN01: 0402B224K160NT; CAD_APPROVED: Yes; FPLIST: CC0402_25,CC0402_HD,0402_CC; Temp Range: -55C to +125C; Tolerance: 10%; ROHS: Yes; HEIGHT: 0.55; VOLTAGE: 16V; Package Size: 0402 [1005 Metric]; Package Type: SMD/SMT; Rated Voltage: 16V; 3D_Mechanical_Footprint_File: http://fcl.am.freescale.net/ALLEGRO/step/cc0402_25.STEP
C10 C32 = CAP_NP: CAP CER 2.2UF 10V 20% X5R 0402; CLASS: DISCRETE; MFG_PN01: C0402C225M8PACTU; MFG_NAME01: KEMET; Temp Range: -55C to +85C; CAD_APPROVED: Yes; FPLIST: CC0402_25,CC0402_HD,0402_CC,capc0402_l; AGILE_PN: 150-79665; 3D_Mechanical_Footprint_File: http://fcl.am.freescale.net/ALLEGRO/step/cc0402_25.STEP; ROHS: Yes; Rated Voltage: 10V; Tolerance: 20%; HEIGHT: 0.55
C15 C21 = CAP_NP: CAP CER 10uF 25V 20% X5R 0603; CLASS: DISCRETE; AGILE_PN: 150-79272; CAD_APPROVED: Yes; Temp Range: -55C to +85C; MFG_NAME01: MURATA; MFG_PN01: GRM188R61E106MA73D; FPLIST: CC0603_OV,CC0603,0603_cc_tol; Package Size: 0603; HEIGHT: 1; Tolerance: 20%; Rated Voltage: 25V; ROHS: Yes
C22-C24 C28-C31 = CAP_NP: CAP CER 0.22UF 16V 10% X7R 0402; CLASS: DISCRETE; Temp Range: -55C to +125C; FPLIST: CC0402_25,CC0402_HD,0402_CC; CAD_APPROVED: Yes; MFG_PN01: 0402B224K160NT; MFG_NAME01: FENGHUA; AGILE_PN: 150-78886; 3D_Mechanical_Footprint_File: http://fcl.am.freescale.net/ALLEGRO/step/cc0402_25.STEP; Rated Voltage: 16V; Package Type: SMD/SMT; Package Size: 0402 [1005 Metric]; VOLTAGE: 16V; HEIGHT: 0.55; ROHS: Yes; Tolerance: 10%
C26 = CAP_NP: CAP CER 1.0uF 16V 10% X6S 0402; CLASS: DISCRETE; Temp Range: -55C to +105C; FPLIST: CC0402_25,CC0402_HD,0402_CC,capc0402_l; CAD_APPROVED: Yes; MFG_PN01: GRM155C81C105KE11D; MFG_NAME01: MURATA; AGILE_PN: 150-80262; SIGNAL_MODEL: DEFAULT_CAPACITOR_1e+06pF_2_1; Temp_Range: -55癈 to +125癈; Rated Voltage: 16V; VOLTAGE: 16V; HEIGHT: 0.55; ROHS: Yes; Tolerance: 10%
Q1 = TRAN_NPN_SOT223: TRANS NPN 80V 1A AEC-Q101 SOT223; CLASS: IC; AGILE_PN: 480-79956; MFG_NAME01: NEXPERIA; Temp_Range: -55癈 ~ 150癈; CAD_APPROVED: Yes; Temp Range: -55°C ~ 150°C; MFG_PN01: BCP56-16TX; ROHS: Yes; HEIGHT: 1.8
R6 R11 R12 R155 = RES: RES MF ZERO OHM 1/10W -- 0603; CLASS: DISCRETE; Temp Range: –55 °C to +155 °C; VOLTAGE: 1/16W; FPLIST: RC0603_OV,RC0603,R603-X2,r603-x2_b,0603_CC,IND_0603HP_NSP,CC0603_OV_NSP; CAD_APPROVED: Yes; MFG_PN01: CRCW06030000Z0EAC; MFG_NAME01: VISHAY; AGILE_PN: 470-80866; ROHS: NULL; HEIGHT: 0.6
R14 = RES: RES MF 2.2K 1/16W 1% 0402; CLASS: DISCRETE; Temp Range: -55 °C to +155 °C; FPLIST: RC0402_25,RC0402_HD,0402_CC; CAD_APPROVED: yes; Temp_Range: -55C to +155C; MFG_PN01: CR0402-FX-2201GLF; MFG_NAME01: Bourns Inc.; AGILE_PN: 470-83213; HEIGHT: 0.4mm; ROHS: NULL; 3D_Mechanical_Footprint_File: http://fcl.am.freescale.net/ALLEGRO/step/rc0402_25.STEP
R156 = RES: RES MF ZERO OHM 1/10W -- 0603; CLASS: DISCRETE; AGILE_PN: 470-80866; MFG_NAME01: VISHAY; MFG_PN01: CRCW06030000Z0EAC; CAD_APPROVED: Yes; FPLIST: RC0603_OV,RC0603,R603-X2,r603-x2_b,0603_CC,IND_0603HP_NSP,CC0603_OV_NSP; VOLTAGE: 1/16W; Temp Range: –55 °C to +155 °C; HEIGHT: 0.6; ROHS: NULL
U1 = MCXE318MPB_172P: as U1 on sheet 04 MCU_AB; CLASS: IC; HEIGHT: 1.75mm; ROHS: NULL; MFG_PN01: MCXE31BMPB; 3D_Mechanical_Footprint_File: http://fcl.am.freescale.net/ALLEGRO/step/hdqfp172_0P65_16X16_sm.STEP
Y1 = XTAL_13: XTAL 16MHz 8pF 15PPM 3225 SMT; CLASS: IC; AGILE_PN: 230-10068; CAD_APPROVED: Yes; Temp Range: -30C to +85C; MFG_NAME01: KYOCERA; Package Size: 3.2 mm x 2.5 mm x 0.6 mm; HEIGHT: 0.6mm; Frequency Tolerance: ±15ppm; ROHS: NULL; 3D_Mechanical_Footprint_File: http://fcl.am.freescale.net/ALLEGRO/step/xtal4_cx3225ca_sm.STEP
Y2 = CRYSTAL: XTAL 32.768kHz 12.5pF 1.05pF 20ppm SMT; CLASS: IC; MFG_NAME01: Wurth Electronics Inc.; CAD_APPROVED: Yes; AGILE_PN: 230-78676; 3D_Mechanical_Footprint_File: http://fcl.am.freescale.net/ALLEGRO/step/xtal2-3p2x1p5-sm.step; ROHS: Yes; HEIGHT: 0.9

## Sheet 06 MCU_PORT.SchDoc
size 513 x 386 mm
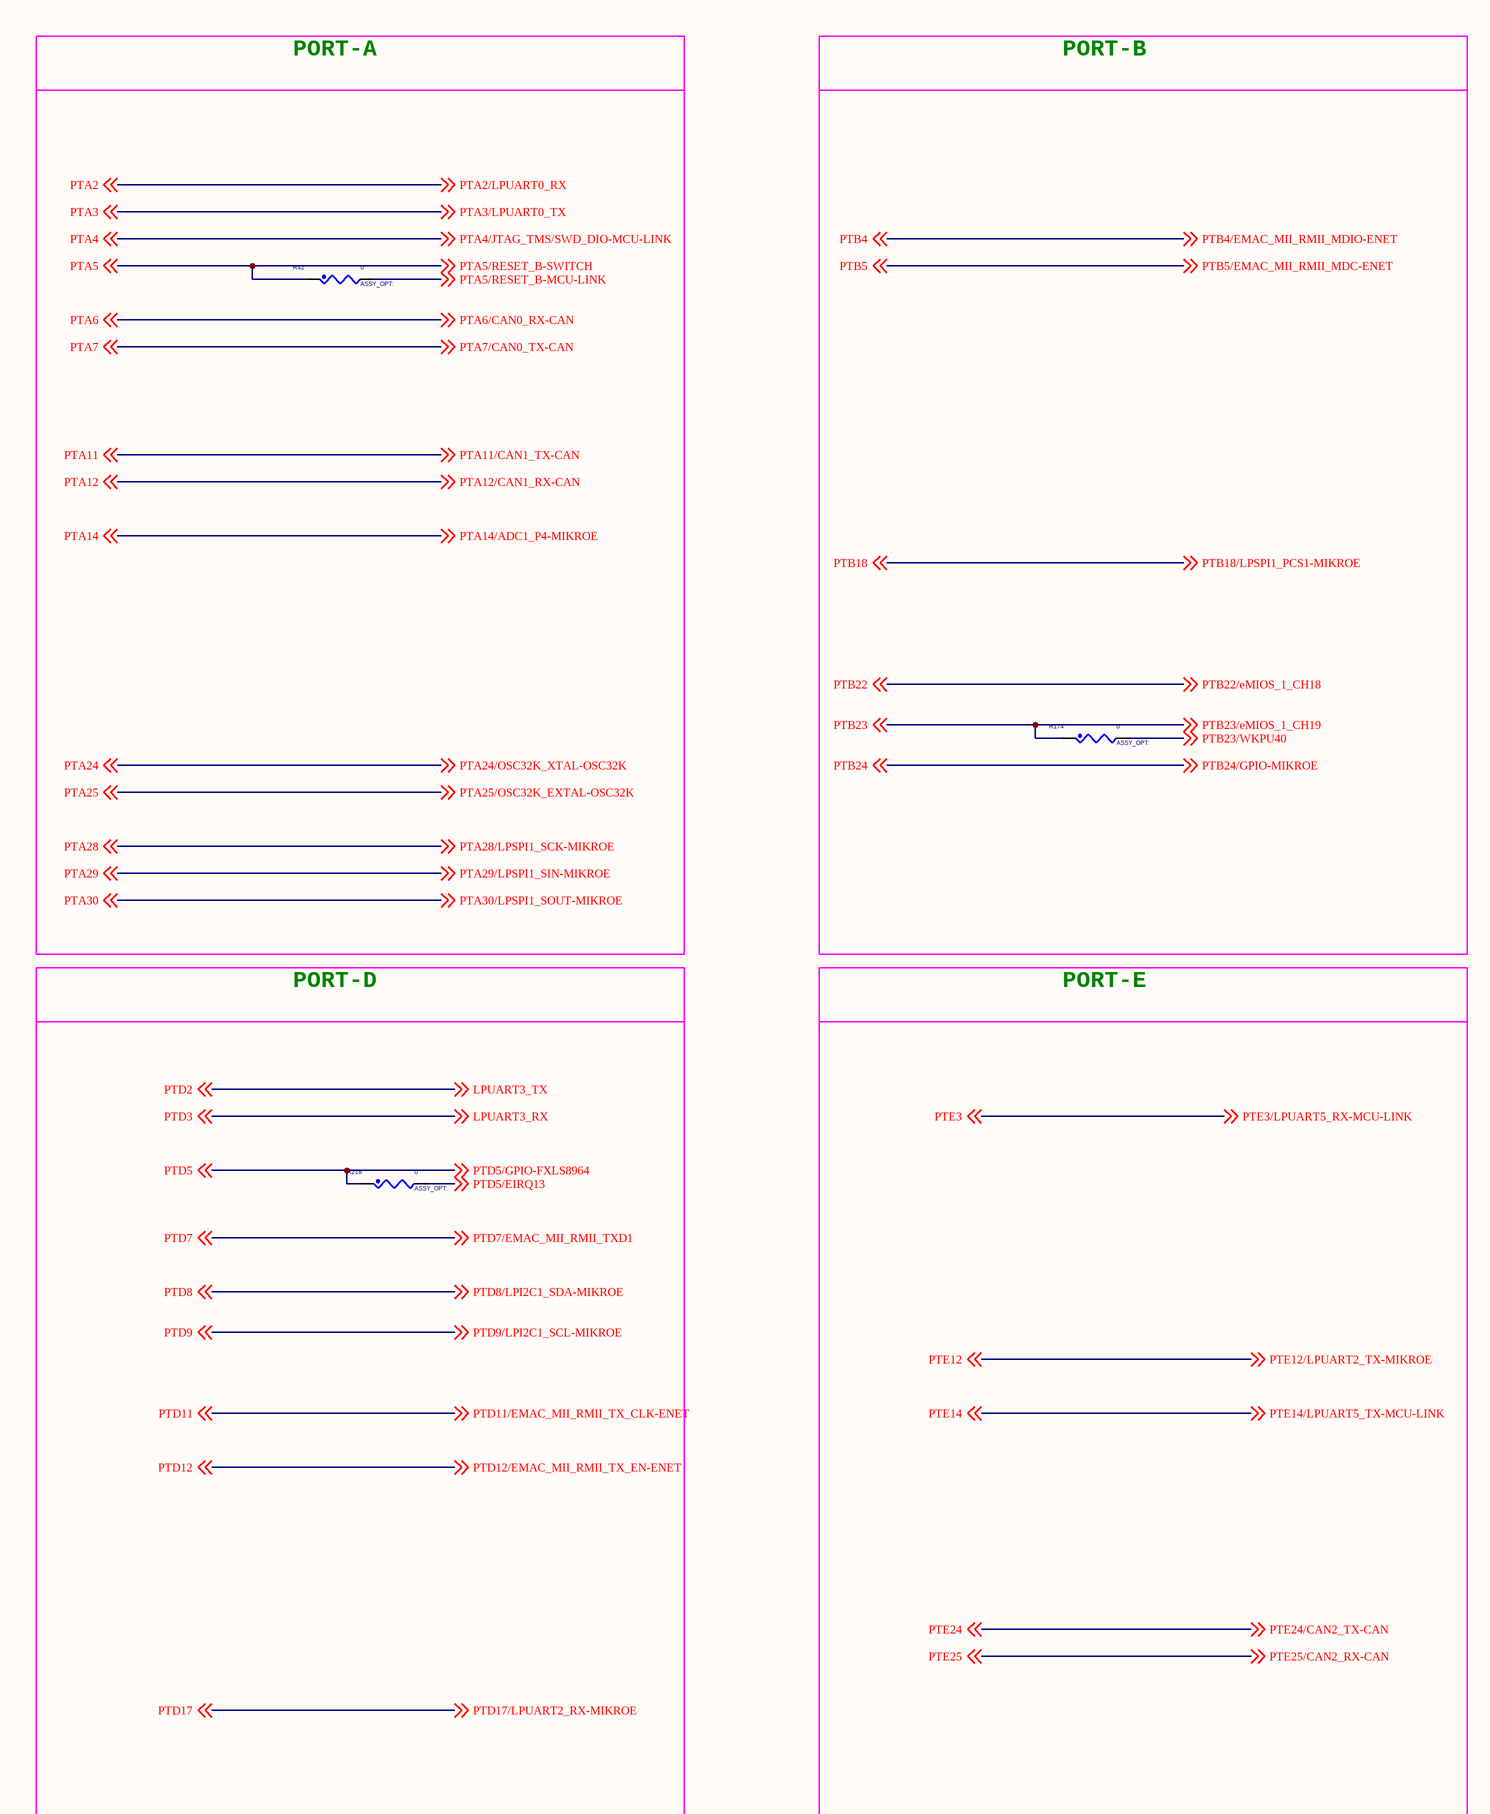
[diagram p5: 06 MCU_PORT.SchDoc, left]
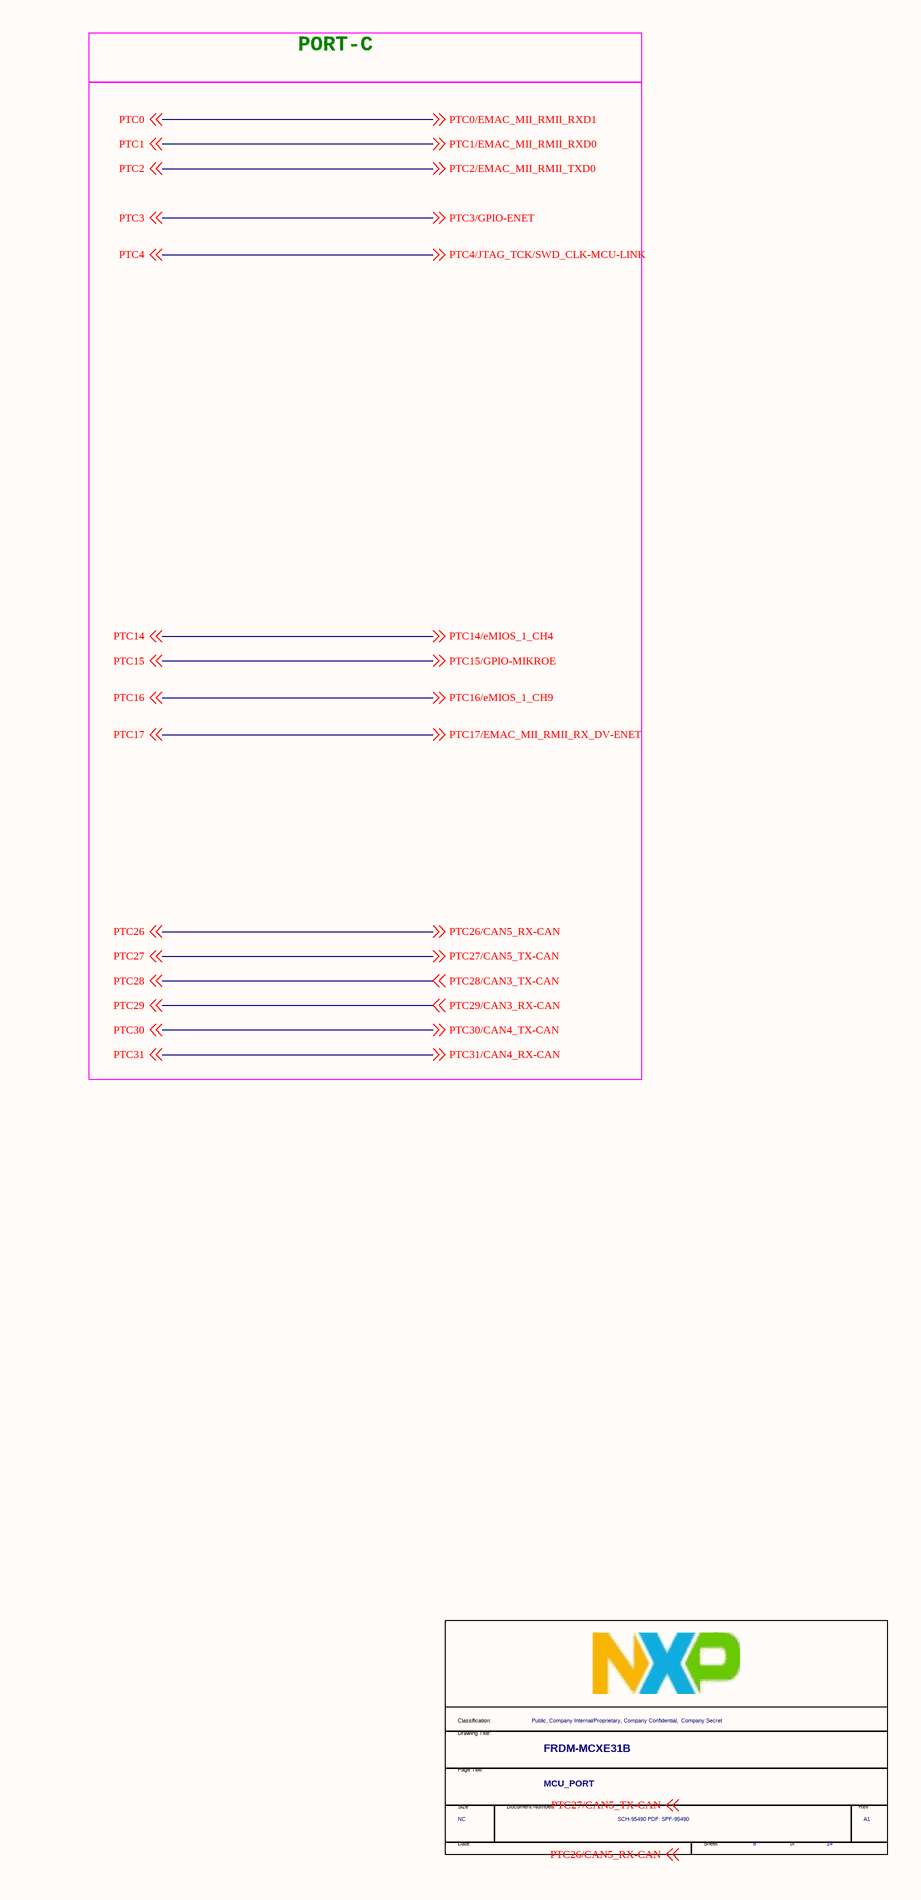
[diagram p6: 06 MCU_PORT.SchDoc, right]

### Parts
(Parts that share a designator on the sheet are numbered #1, #2 ... from top to bottom, then left to right.)
*#4  Title: FRDM-MCXE31B  RevCode: A1  PageTitle: MCU_PORT  Page Size: NC  Page Number: 6  Page Count: 14  Doc: SCH-95490 PDF: SPF-95490  Classification: Public, Company Internal/Proprietary, Company Confidential,  Company Secret  (hidden comment: TitleBlock_FS)  (graphical)
R42  0  [RC0402_25]
R174  0  [RC0603_OV]
R218  0  [RC0603_OV]

### Nets
LPUART3_RX: off-sheet PTD3, off-sheet LPUART3_RX  [also labelled PTD3]
LPUART3_TX: off-sheet PTD2, off-sheet LPUART3_TX  [also labelled PTD2]
PTA2: off-sheet PTA2, off-sheet PTA2/LPUART0_RX  [also labelled PTA2/LPUART0_RX]
PTA3: off-sheet PTA3, off-sheet PTA3/LPUART0_TX  [also labelled PTA3/LPUART0_TX]
PTA4: off-sheet PTA4, off-sheet PTA4/JTAG_TMS/SWD_DIO-MCU-LINK  [also labelled PTA4/JTAG_TMS/SWD_DIO-MCU-LINK]
PTA5: R42.1 ; off-sheet PTA5, off-sheet PTA5/RESET_B-SWITCH  [also labelled PTA5/RESET_B-SWITCH]
PTA5/RESET_B-MCU-LINK: R42.2 ; off-sheet PTA5/RESET_B-MCU-LINK
PTA6: off-sheet PTA6, off-sheet PTA6/CAN0_RX-CAN  [also labelled PTA6/CAN0_RX-CAN]
PTA7: off-sheet PTA7, off-sheet PTA7/CAN0_TX-CAN  [also labelled PTA7/CAN0_TX-CAN]
PTA11: off-sheet PTA11, off-sheet PTA11/CAN1_TX-CAN  [also labelled PTA11/CAN1_TX-CAN]
PTA12: off-sheet PTA12, off-sheet PTA12/CAN1_RX-CAN  [also labelled PTA12/CAN1_RX-CAN]
PTA14: off-sheet PTA14, off-sheet PTA14/ADC1_P4-MIKROE  [also labelled PTA14/ADC1_P4-MIKROE]
PTA24: off-sheet PTA24, off-sheet PTA24/OSC32K_XTAL-OSC32K  [also labelled PTA24/OSC32K_XTAL-OSC32K]
PTA25: off-sheet PTA25, off-sheet PTA25/OSC32K_EXTAL-OSC32K  [also labelled PTA25/OSC32K_EXTAL-OSC32K]
PTA28: off-sheet PTA28, off-sheet PTA28/LPSPI1_SCK-MIKROE  [also labelled PTA28/LPSPI1_SCK-MIKROE]
PTA29: off-sheet PTA29, off-sheet PTA29/LPSPI1_SIN-MIKROE  [also labelled PTA29/LPSPI1_SIN-MIKROE]
PTA30: off-sheet PTA30, off-sheet PTA30/LPSPI1_SOUT-MIKROE  [also labelled PTA30/LPSPI1_SOUT-MIKROE]
PTB4: off-sheet PTB4, off-sheet PTB4/EMAC_MII_RMII_MDIO-ENET  [also labelled PTB4/EMAC_MII_RMII_MDIO-ENET]  [project net ENET_MDIO]
PTB5: off-sheet PTB5, off-sheet PTB5/EMAC_MII_RMII_MDC-ENET  [also labelled PTB5/EMAC_MII_RMII_MDC-ENET]  [project net ENET_MDC]
PTB18: off-sheet PTB18, off-sheet PTB18/LPSPI1_PCS1-MIKROE  [also labelled PTB18/LPSPI1_PCS1-MIKROE]
PTB22: off-sheet PTB22, off-sheet PTB22/eMIOS_1_CH18  [also labelled PTB22/eMIOS_1_CH18]
PTB23: R174.1 ; off-sheet PTB23, off-sheet PTB23/eMIOS_1_CH19  [also labelled PTB23/eMIOS_1_CH19]
PTB23/WKPU40: R174.2 ; off-sheet PTB23/WKPU40
PTB24: off-sheet PTB24, off-sheet PTB24/GPIO-MIKROE  [also labelled PTB24/GPIO-MIKROE]
PTC0: off-sheet PTC0, off-sheet PTC0/EMAC_MII_RMII_RXD1  [also labelled PTC0/EMAC_MII_RMII_RXD1]  [project net ENET_RXD1/MODE1]
PTC1: off-sheet PTC1, off-sheet PTC1/EMAC_MII_RMII_RXD0  [also labelled PTC1/EMAC_MII_RMII_RXD0]  [project net ENET_RXD0/MODE0]
PTC2: off-sheet PTC2, off-sheet PTC2/EMAC_MII_RMII_TXD0  [also labelled PTC2/EMAC_MII_RMII_TXD0]  [project net ENET_TXD0]
PTC3: off-sheet PTC3, off-sheet PTC3/GPIO-ENET  [also labelled PTC3/GPIO-ENET]  [project net ENET_PHY_RST]
PTC4: off-sheet PTC4, off-sheet PTC4/JTAG_TCK/SWD_CLK-MCU-LINK  [also labelled PTC4/JTAG_TCK/SWD_CLK-MCU-LINK]
PTC14: off-sheet PTC14, off-sheet PTC14/eMIOS_1_CH4  [also labelled PTC14/eMIOS_1_CH4]
PTC15: off-sheet PTC15, off-sheet PTC15/GPIO-MIKROE  [also labelled PTC15/GPIO-MIKROE]
PTC16: off-sheet PTC16, off-sheet PTC16/eMIOS_1_CH9  [also labelled PTC16/eMIOS_1_CH9]
PTC17: off-sheet PTC17, off-sheet PTC17/EMAC_MII_RMII_RX_DV-ENET  [also labelled PTC17/EMAC_MII_RMII_RX_DV-ENET]  [project net ENET_CRS_DV/MODE2]
PTC26: off-sheet PTC26, off-sheet PTC26/CAN5_RX-CAN  [also labelled PTC26/CAN5_RX-CAN]
PTC27: off-sheet PTC27, off-sheet PTC27/CAN5_TX-CAN  [also labelled PTC27/CAN5_TX-CAN]
PTC28: off-sheet PTC28, off-sheet PTC28/CAN3_TX-CAN  [also labelled PTC28/CAN3_TX-CAN]
PTC29: off-sheet PTC29, off-sheet PTC29/CAN3_RX-CAN  [also labelled PTC29/CAN3_RX-CAN]
PTC30: off-sheet PTC30, off-sheet PTC30/CAN4_TX-CAN  [also labelled PTC30/CAN4_TX-CAN]
PTC31: off-sheet PTC31, off-sheet PTC31/CAN4_RX-CAN  [also labelled PTC31/CAN4_RX-CAN]
PTD5: R218.1 ; off-sheet PTD5, off-sheet PTD5/GPIO-FXLS8964  [also labelled PTD5/GPIO-FXLS8964]
PTD5/EIRQ13: R218.2 ; off-sheet PTD5/EIRQ13
PTD7: off-sheet PTD7, off-sheet PTD7/EMAC_MII_RMII_TXD1  [also labelled PTD7/EMAC_MII_RMII_TXD1]  [project net ENET_TXD1]
PTD8: off-sheet PTD8, off-sheet PTD8/LPI2C1_SDA-MIKROE  [also labelled PTD8/LPI2C1_SDA-MIKROE]
PTD9: off-sheet PTD9, off-sheet PTD9/LPI2C1_SCL-MIKROE  [also labelled PTD9/LPI2C1_SCL-MIKROE]
PTD11: off-sheet PTD11, off-sheet PTD11/EMAC_MII_RMII_TX_CLK-ENET  [also labelled PTD11/EMAC_MII_RMII_TX_CLK-ENET]  [project net ENET_TXCLK]
PTD12: off-sheet PTD12, off-sheet PTD12/EMAC_MII_RMII_TX_EN-ENET  [also labelled PTD12/EMAC_MII_RMII_TX_EN-ENET]  [project net ENET_TXEN]
PTD17: off-sheet PTD17, off-sheet PTD17/LPUART2_RX-MIKROE  [also labelled PTD17/LPUART2_RX-MIKROE]
PTE3: off-sheet PTE3, off-sheet PTE3/LPUART5_RX-MCU-LINK  [also labelled PTE3/LPUART5_RX-MCU-LINK]
PTE12: off-sheet PTE12, off-sheet PTE12/LPUART2_TX-MIKROE  [also labelled PTE12/LPUART2_TX-MIKROE]
PTE14: off-sheet PTE14, off-sheet PTE14/LPUART5_TX-MCU-LINK  [also labelled PTE14/LPUART5_TX-MCU-LINK]
PTE24: off-sheet PTE24, off-sheet PTE24/CAN2_TX-CAN  [also labelled PTE24/CAN2_TX-CAN]
PTE25: off-sheet PTE25, off-sheet PTE25/CAN2_RX-CAN  [also labelled PTE25/CAN2_RX-CAN]

### Notes on the sheet
- PORT-A
- PORT-B
- PORT-C
- PORT-D
- PORT-E
- Labels drawn without touching a wire or pin: PTC26/CAN5_RX-CAN, PTC27/CAN5_TX-CAN
- (in symbol TitleBlock_FS) Classification:; Drawing Title:; Page Title:; Size; Document Number; Rev; Date:; Sheet; of

### Library data of the parts
*#4 = TitleBlock_FS: Variant Name: <Core Design>; OrgAddr2: Austin, TX 78735-8598; OrgAddr1: 6501 William Cannon Drive West; OrgName: NXP Semiconductors; Classification: Company Internal/Proprietary; Page Create Date: March  8, 1995
R42 R174 R218 = RES: as R6 on sheet 05 MCU_C; ROHS: NULL; HEIGHT: 0.6

## Sheet 07 MCU_LINK.SchDoc
size 513 x 386 mm
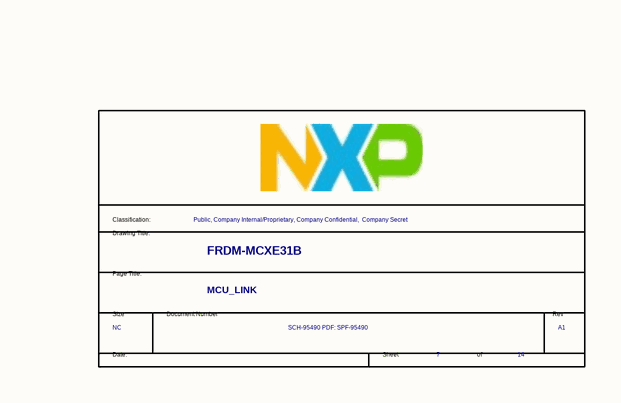
[diagram p7: 07 MCU_LINK.SchDoc, right]

### Parts
(Parts that share a designator on the sheet are numbered #1, #2 ... from top to bottom, then left to right.)
*#5  Title: FRDM-MCXE31B  RevCode: A1  PageTitle: MCU_LINK  Page Size: NC  Page Number: 7  Page Count: 14  Doc: SCH-95490 PDF: SPF-95490  Classification: Public, Company Internal/Proprietary, Company Confidential,  Company Secret  (hidden comment: TitleBlock_FS)  (graphical)

### Notes on the sheet
- (in symbol TitleBlock_FS) Classification:; Drawing Title:; Page Title:; Size; Document Number; Rev; Date:; Sheet; of

### Library data of the parts
*#5 = TitleBlock_FS: as *#4 on sheet 06 MCU_PORT; Page Create Date: March  8, 1995

## Sheet 08 MCU_LINK_DEBUG.SchDoc
size 513 x 386 mm
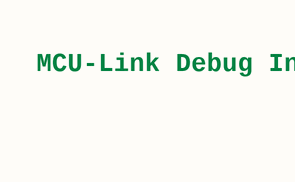
[diagram p8: 08 MCU_LINK_DEBUG.SchDoc, left]
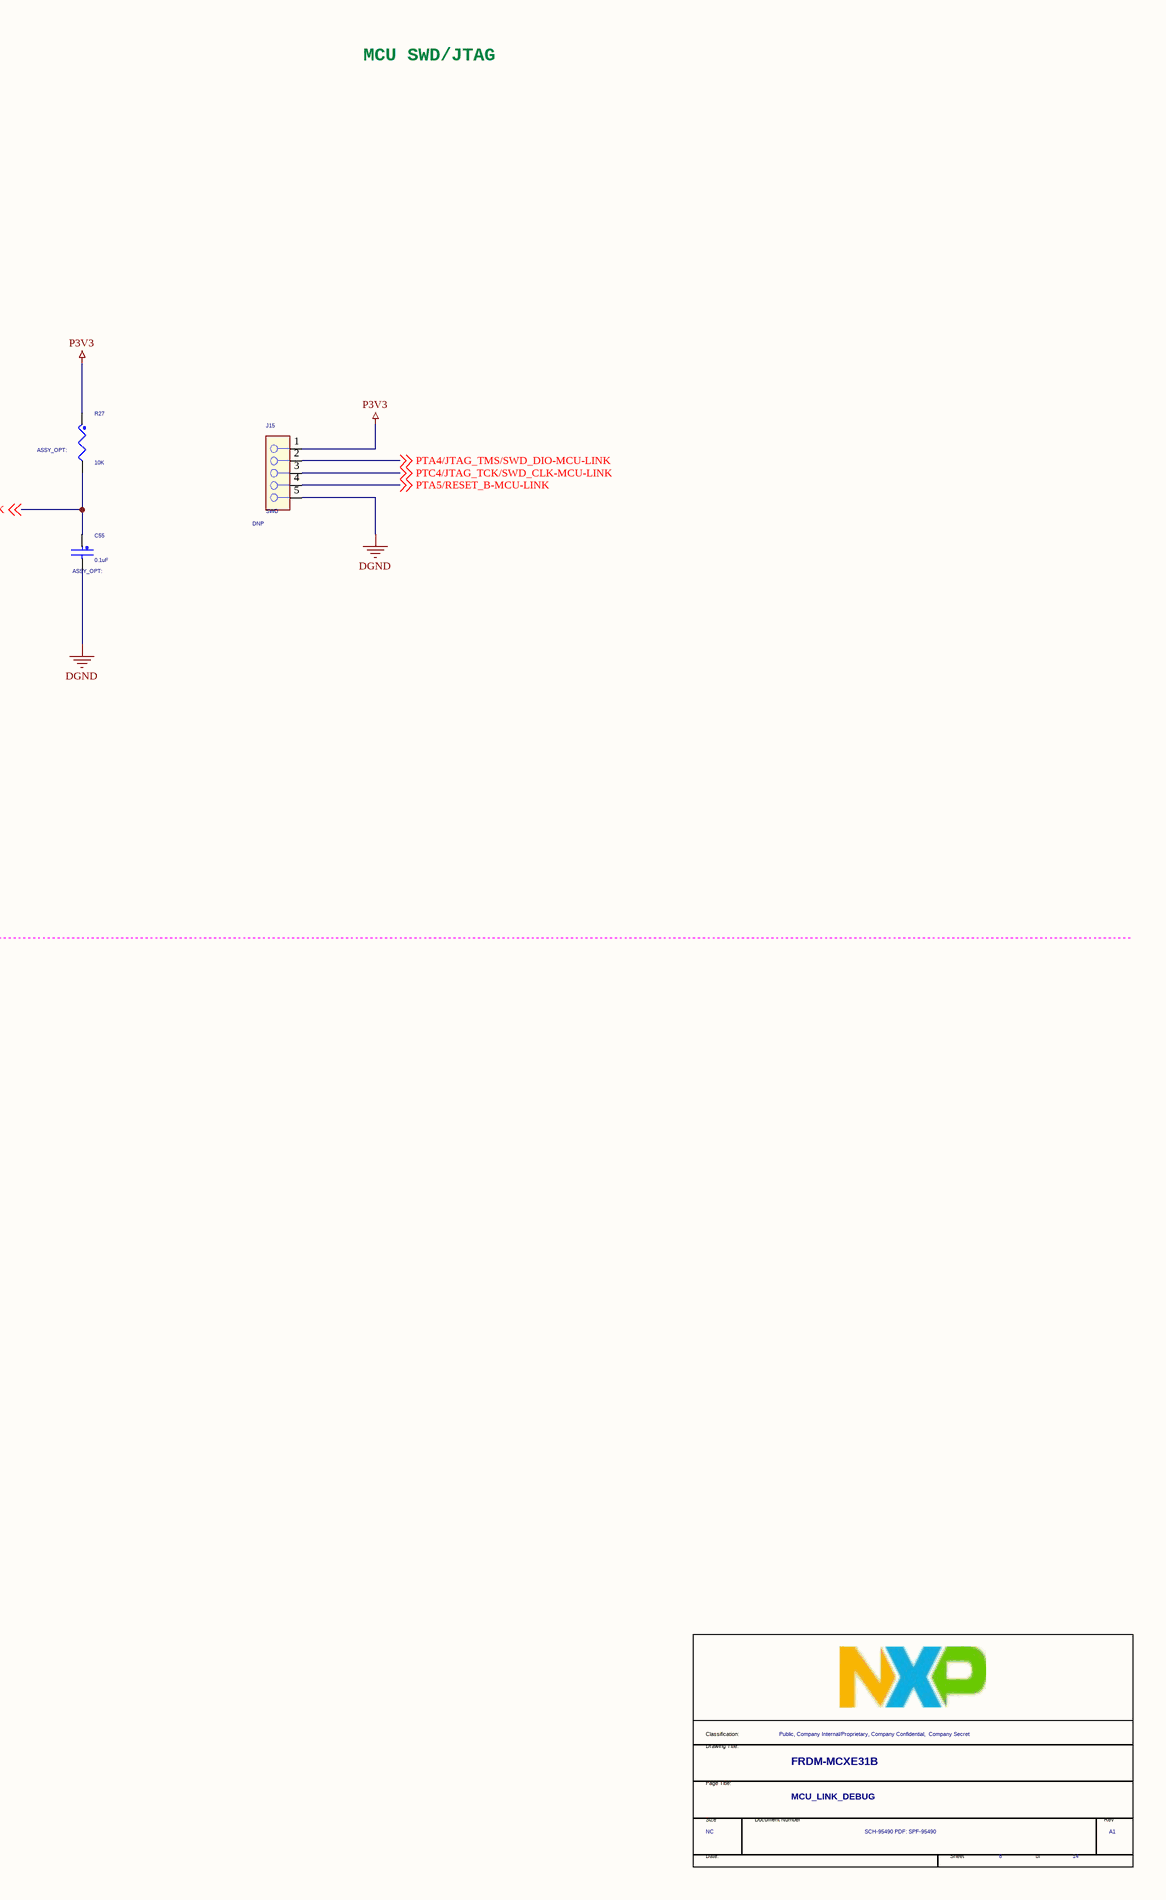
[diagram p9: 08 MCU_LINK_DEBUG.SchDoc, right]

### Parts
(Parts that share a designator on the sheet are numbered #1, #2 ... from top to bottom, then left to right.)
*#6  Title: FRDM-MCXE31B  RevCode: A1  PageTitle: MCU_LINK_DEBUG  Page Size: NC  Page Number: 8  Page Count: 14  Doc: SCH-95490 PDF: SPF-95490  Classification: Public, Company Internal/Proprietary, Company Confidential,  Company Secret  (hidden comment: TitleBlock_FS)  (graphical)
C55  0.1uF  [CC0402_25]
J15  ASSY_OPT: DNP  SILK: SWD  [HDR2.54-Y-LI-5P]  (hidden comment: HDR_1X5)
R27  10K  [RC0402_25]

### Nets
DGND: C55.2 J15.5
P3V3: J15.1 R27.1
PTA4/JTAG_TMS/SWD_DIO-MCU-LINK: J15.2 ; off-sheet PTA4/JTAG_TMS/SWD_DIO-MCU-LINK  [project net PTA4]
PTA5/RESET_B-MCU-LINK: C55.1 J15.4 R27.2 ; off-sheet PTA5/RESET_B-MCU-LINK
PTC4/JTAG_TCK/SWD_CLK-MCU-LINK: J15.3 ; off-sheet PTC4/JTAG_TCK/SWD_CLK-MCU-LINK  [project net PTC4]

### Notes on the sheet
- MCU-Link Debug Interface
- MCU SWD/JTAG
- (in symbol TitleBlock_FS) Classification:; Drawing Title:; Page Title:; Size; Document Number; Rev; Date:; Sheet; of

### Library data of the parts
*#6 = TitleBlock_FS: Classification: Company Internal/Proprietary; OrgName: NXP Semiconductors; OrgAddr1: 6501 William Cannon Drive West; OrgAddr2: Austin, TX 78735-8598; Variant Name: <Core Design>; Page Create Date: March  8, 1995
C55 = CAP_NP: as C3 on sheet 03 POWER; VOLTAGE: 16V; TOL: 10%; HEIGHT: 0.635mm; ROHS: NULL; Tolerance: 10%; Rated Voltage: 16V; 3D_Mechanical_Footprint_File: http://fcl.am.freescale.net/ALLEGRO/step/cc0402_25.STEP
J15 = CONN_HDR_5X1: HDR 1X5 RA TH 100MIL 108H AU 120L; CLASS: IO; MFG_PN01: PRPC005SGAN-M71RC; MFG_NAME01: SULLINS ELECTRONICS CORP; Temp Range: -40° C to + 105° C; CAD_APPROVED: Yes; AGILE_PN: 210-10219; 3D_Mechanical_Footprint_File: http://fcl.am.freescale.net/ALLEGRO/step/con1x5_2p54_th_ra.STEP; ROHS: NULL; Contact Voltage: -; Package Type: Through Hole, Right Angle; HEIGHT: 2.74MM
R27 = RES: RES MF 10K 1/16W 5% 0402; CLASS: DISCRETE; Temp_Range: ?5 癈 to +155 癈; FPLIST: RC0402_25,RC0402_HD,0402_CC; CAD_APPROVED: Yes; MFG_PN01: CR0402-JW-103GLF; MFG_NAME01: BOURNS; AGILE_PN: 470-75557; SIGNAL_MODEL: DEFAULT_RESISTOR_10000OHM_2_1; HEIGHT: 0.4MM; TOL: 5%; ROHS: NULL; Tolerance: 5%